# EAGLE schematic UCirKitBreadboardWithEverything3 (EAGLE 7.3.0), part 1 of 3
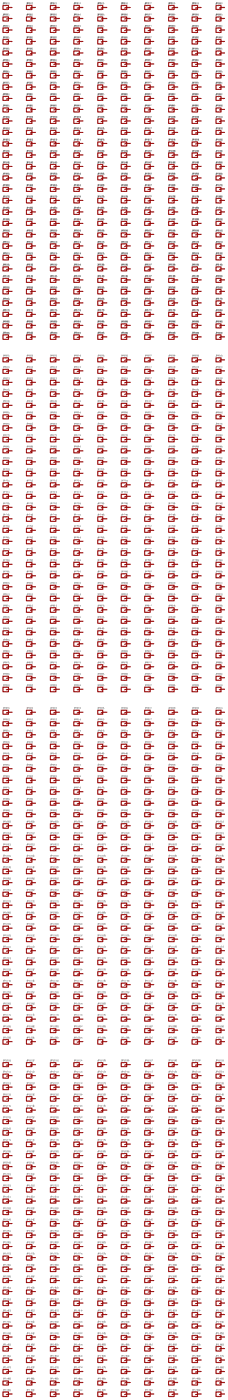
[diagram p0: schematic, sheet 1, overview]
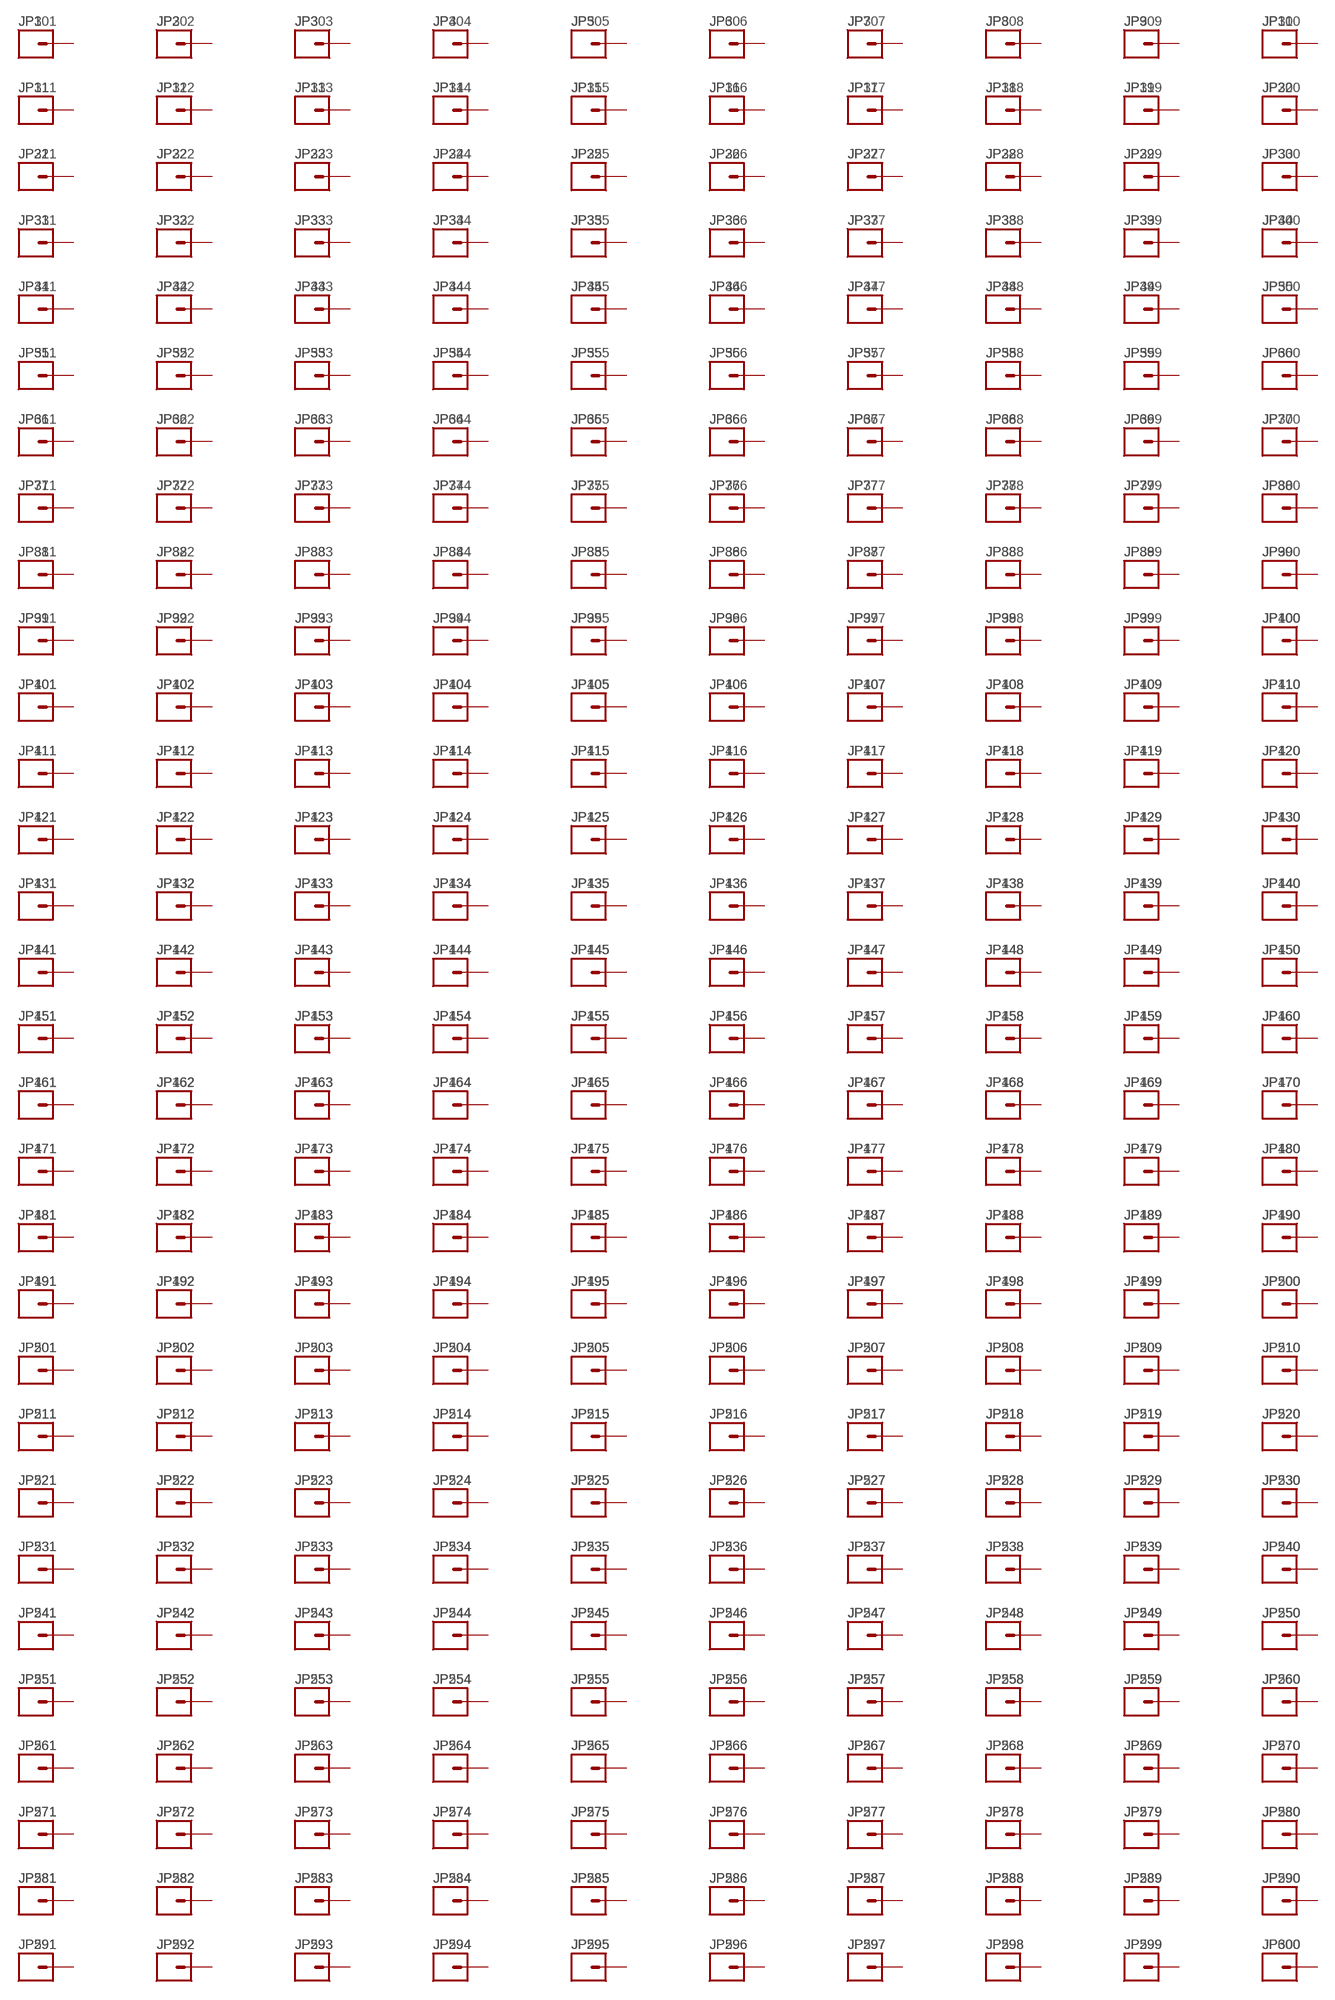
[diagram p1: schematic, sheet 1, part 1 of 4]
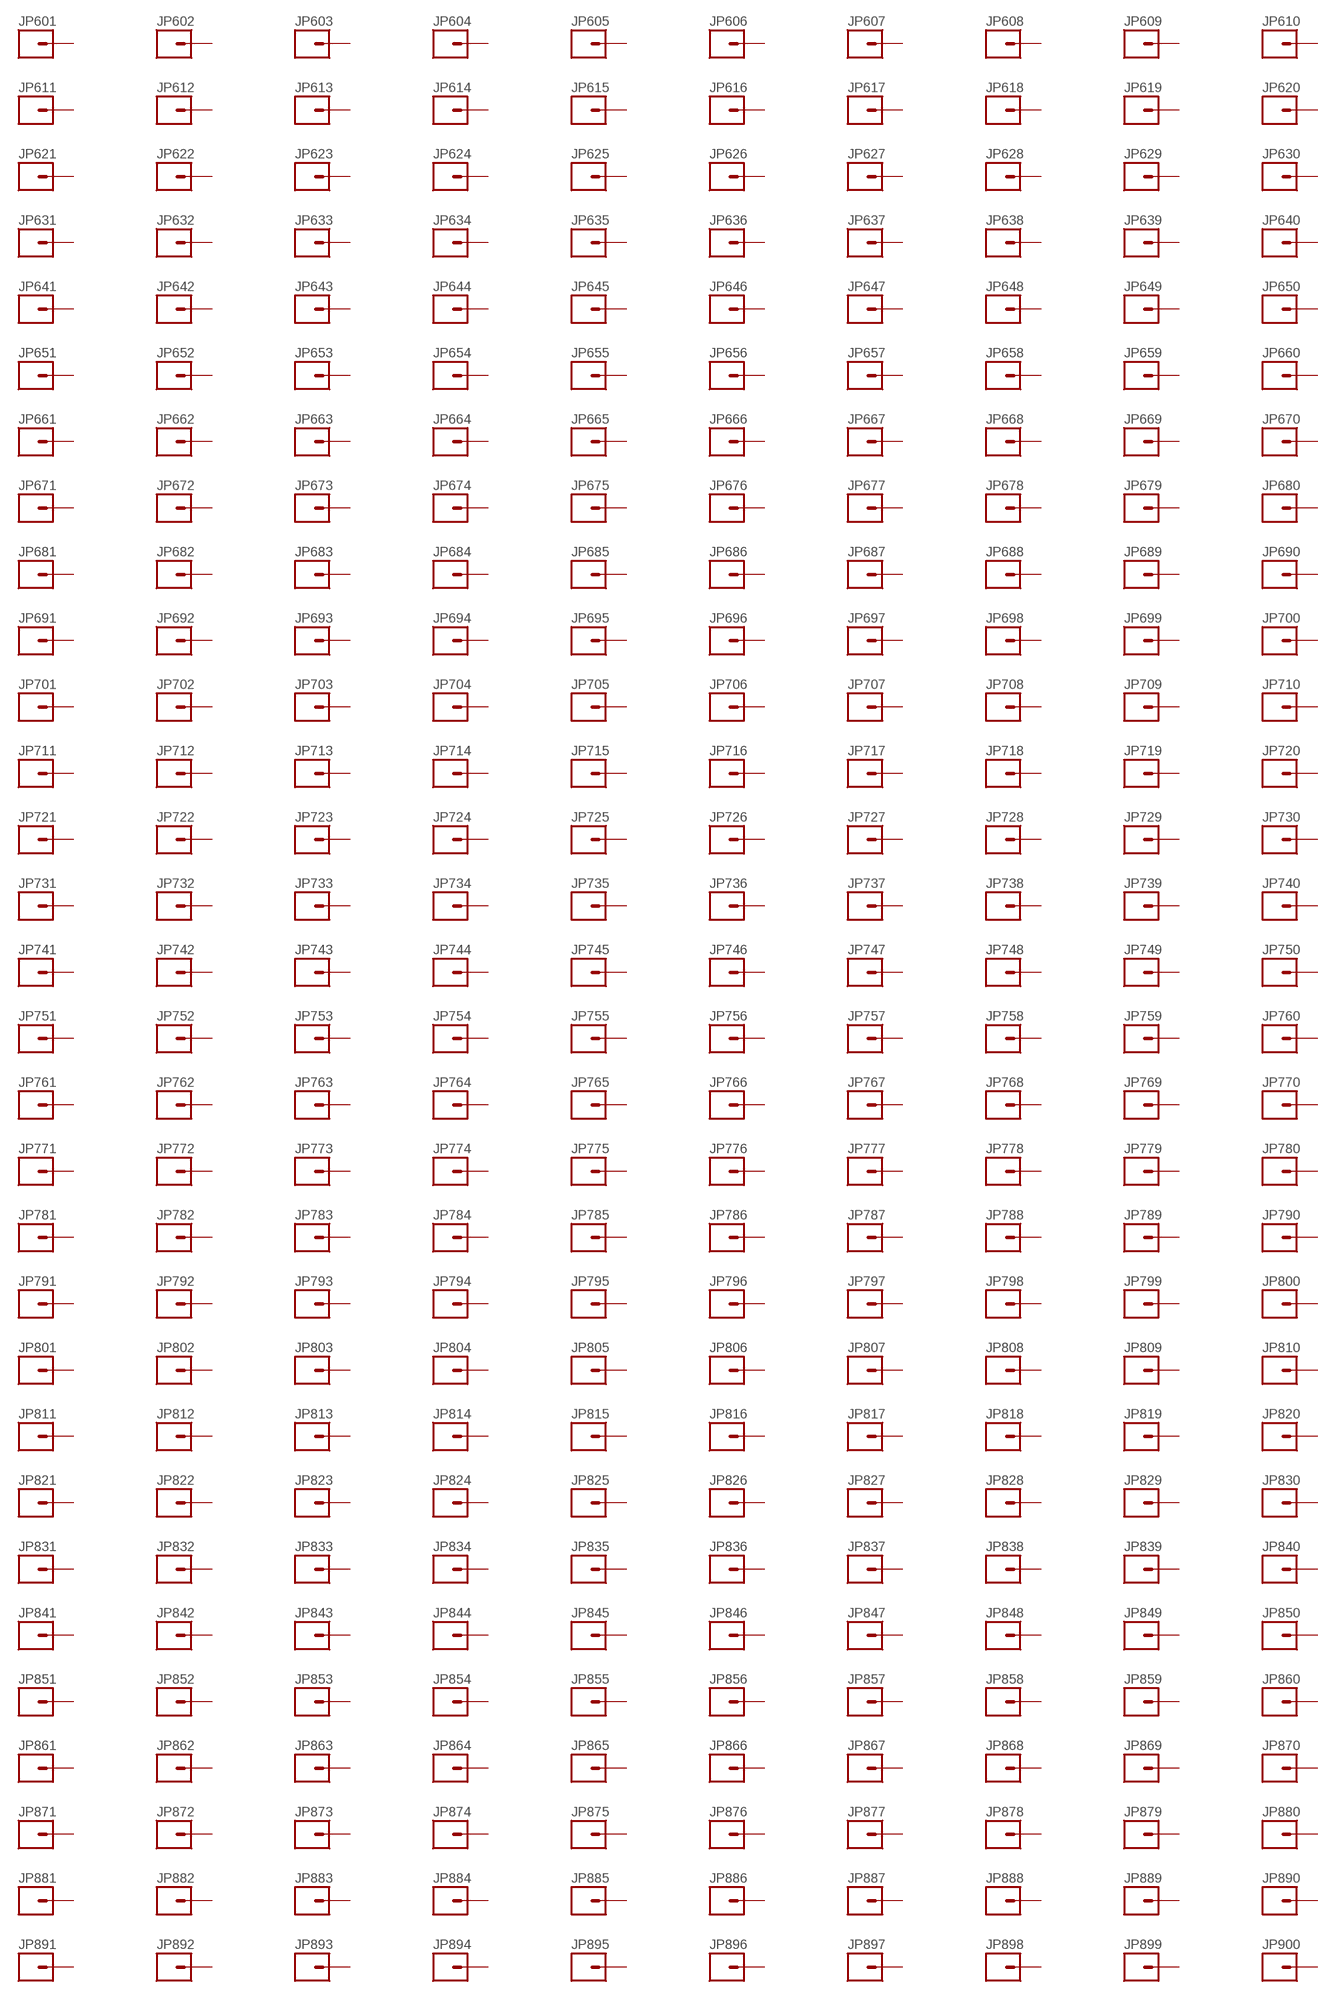
[diagram p2: schematic, sheet 1, part 2 of 4]
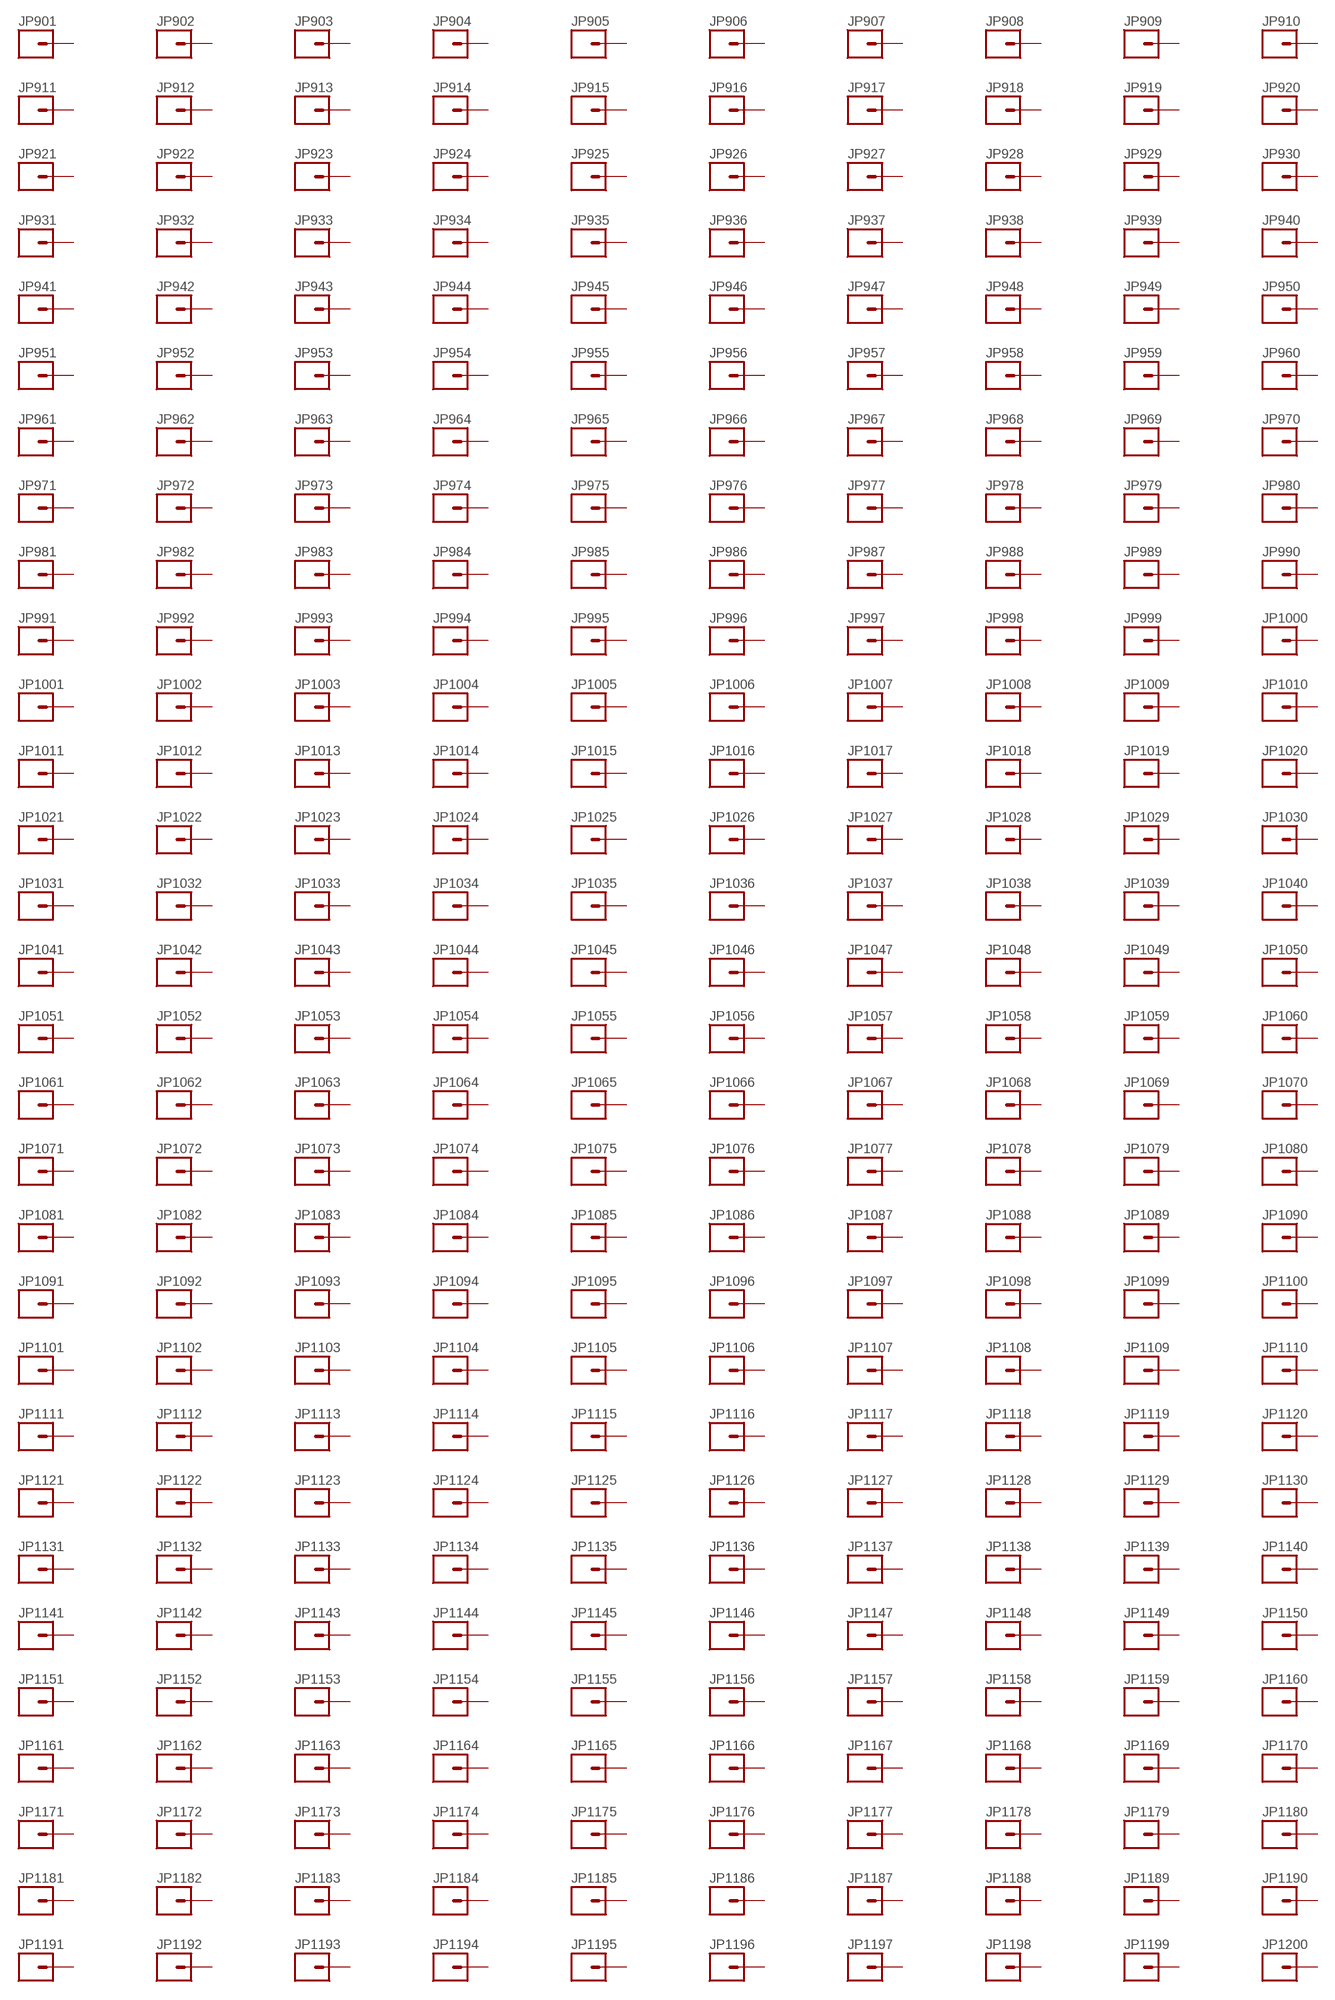
[diagram p3: schematic, sheet 1, part 3 of 4]
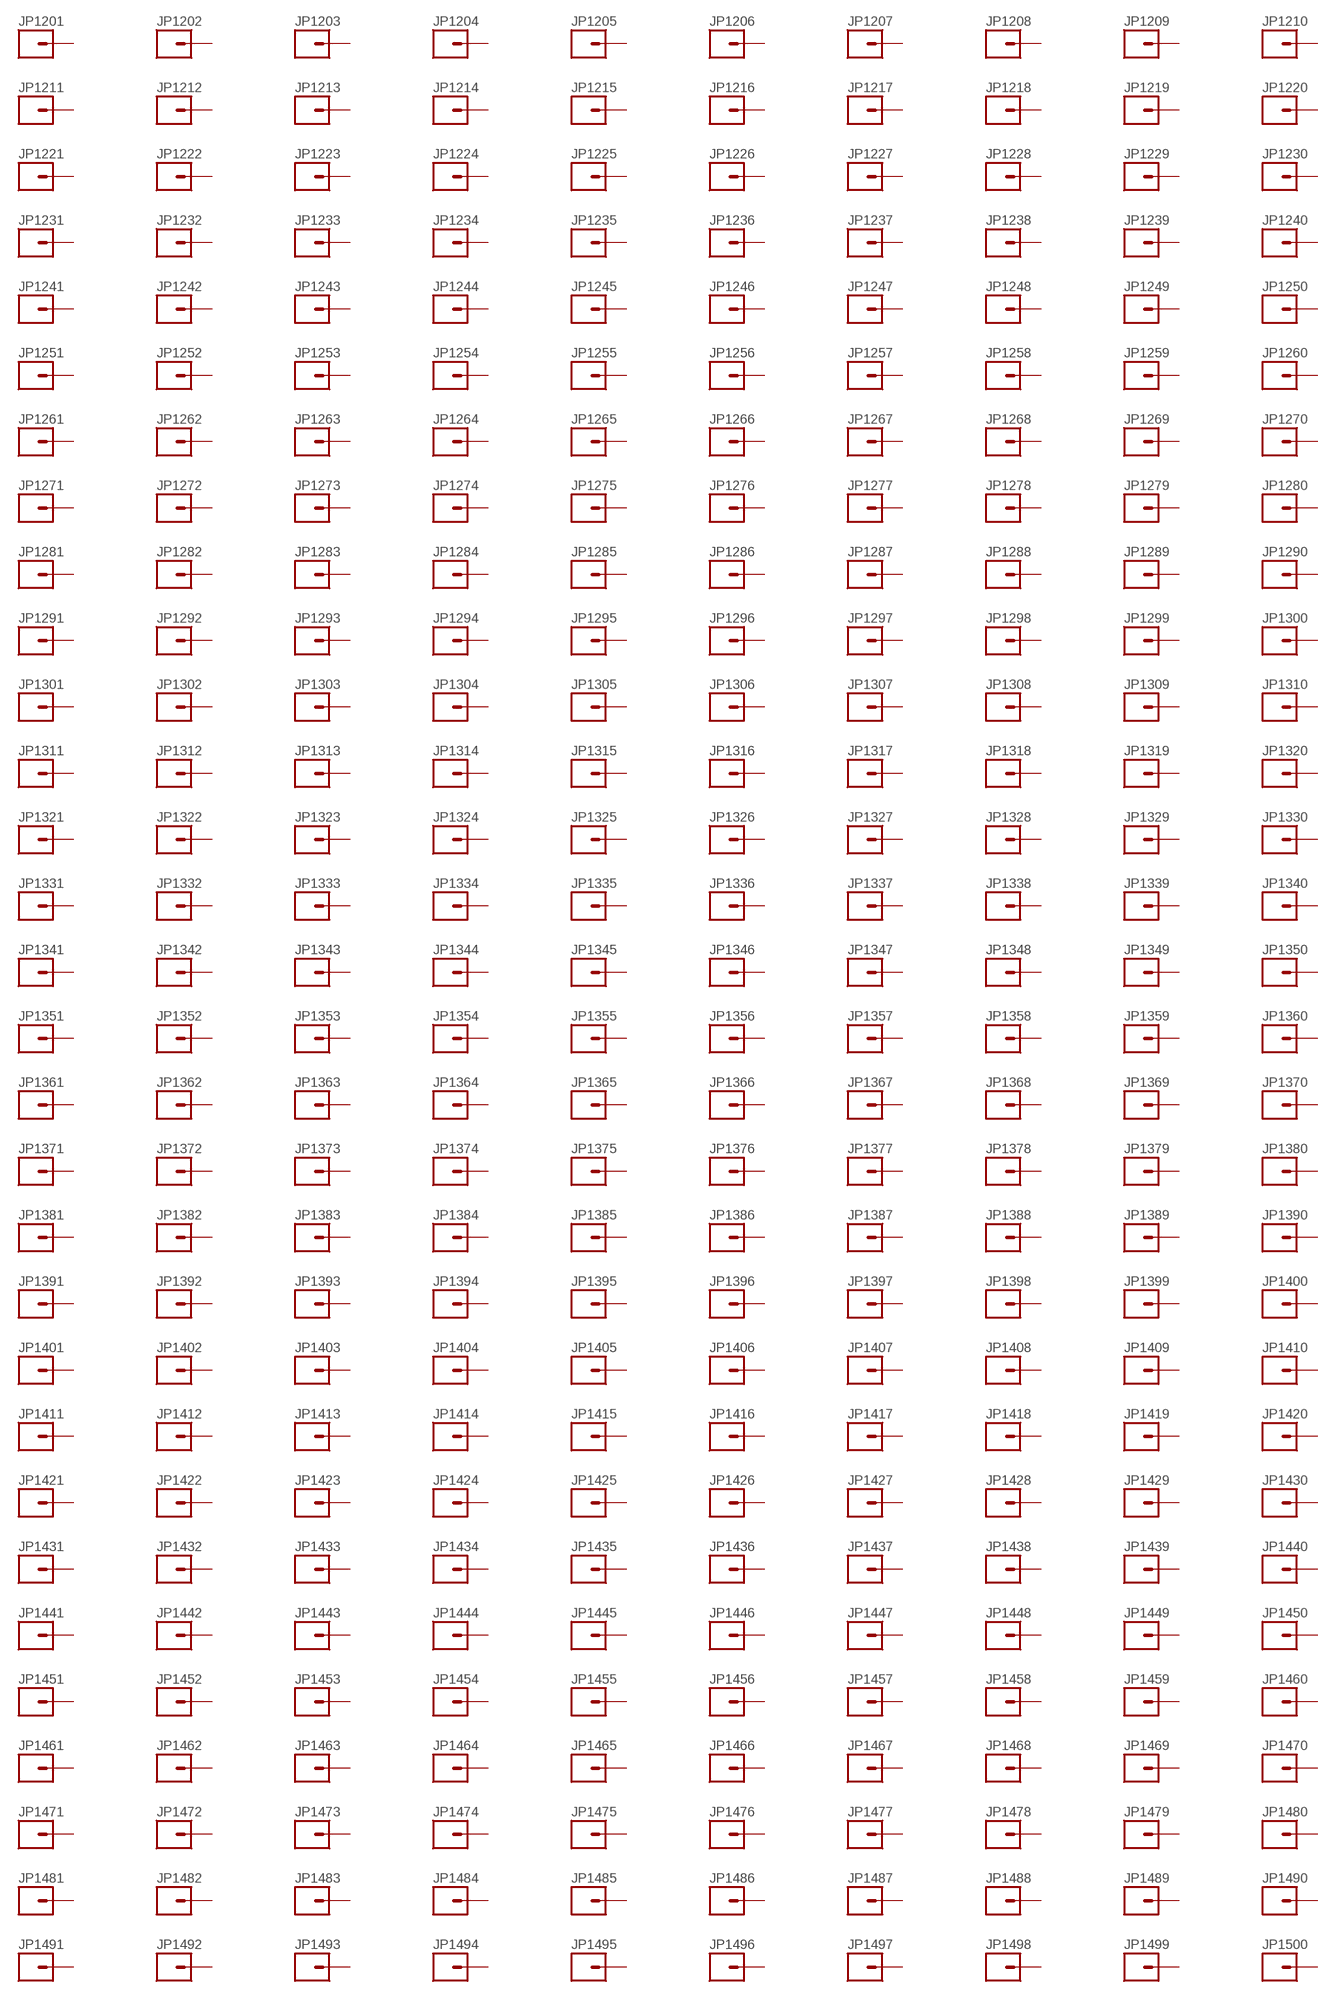
[diagram p4: schematic, sheet 1, part 4 of 4]

## Parts
JP1  M01PTH_WITHOUT_TEXT  [1X01_WITHOUT_TEXT]
JP2  M01PTH_WITHOUT_TEXT  [1X01_WITHOUT_TEXT]
JP3  M01PTH_WITHOUT_TEXT  [1X01_WITHOUT_TEXT]
JP4  M01PTH_WITHOUT_TEXT  [1X01_WITHOUT_TEXT]
JP5  M01PTH_WITHOUT_TEXT  [1X01_WITHOUT_TEXT]
JP6  M01PTH_WITHOUT_TEXT  [1X01_WITHOUT_TEXT]
JP7  M01PTH_WITHOUT_TEXT  [1X01_WITHOUT_TEXT]
JP8  M01PTH_WITHOUT_TEXT  [1X01_WITHOUT_TEXT]
JP9  M01PTH_WITHOUT_TEXT  [1X01_WITHOUT_TEXT]
JP10  M01PTH_WITHOUT_TEXT  [1X01_WITHOUT_TEXT]
JP11  M01PTH_WITHOUT_TEXT  [1X01_WITHOUT_TEXT]
JP12  M01PTH_WITHOUT_TEXT  [1X01_WITHOUT_TEXT]
JP13  M01PTH_WITHOUT_TEXT  [1X01_WITHOUT_TEXT]
JP14  M01PTH_WITHOUT_TEXT  [1X01_WITHOUT_TEXT]
JP15  M01PTH_WITHOUT_TEXT  [1X01_WITHOUT_TEXT]
JP16  M01PTH_WITHOUT_TEXT  [1X01_WITHOUT_TEXT]
JP17  M01PTH_WITHOUT_TEXT  [1X01_WITHOUT_TEXT]
JP18  M01PTH_WITHOUT_TEXT  [1X01_WITHOUT_TEXT]
JP19  M01PTH_WITHOUT_TEXT  [1X01_WITHOUT_TEXT]
JP20  M01PTH_WITHOUT_TEXT  [1X01_WITHOUT_TEXT]
JP21  M01PTH_WITHOUT_TEXT  [1X01_WITHOUT_TEXT]
JP22  M01PTH_WITHOUT_TEXT  [1X01_WITHOUT_TEXT]
JP23  M01PTH_WITHOUT_TEXT  [1X01_WITHOUT_TEXT]
JP24  M01PTH_WITHOUT_TEXT  [1X01_WITHOUT_TEXT]
JP25  M01PTH_WITHOUT_TEXT  [1X01_WITHOUT_TEXT]
JP26  M01PTH_WITHOUT_TEXT  [1X01_WITHOUT_TEXT]
JP27  M01PTH_WITHOUT_TEXT  [1X01_WITHOUT_TEXT]
JP28  M01PTH_WITHOUT_TEXT  [1X01_WITHOUT_TEXT]
JP29  M01PTH_WITHOUT_TEXT  [1X01_WITHOUT_TEXT]
JP30  M01PTH_WITHOUT_TEXT  [1X01_WITHOUT_TEXT]
JP31  M01PTH_WITHOUT_TEXT  [1X01_WITHOUT_TEXT]
JP32  M01PTH_WITHOUT_TEXT  [1X01_WITHOUT_TEXT]
JP33  M01PTH_WITHOUT_TEXT  [1X01_WITHOUT_TEXT]
JP34  M01PTH_WITHOUT_TEXT  [1X01_WITHOUT_TEXT]
JP35  M01PTH_WITHOUT_TEXT  [1X01_WITHOUT_TEXT]
JP36  M01PTH_WITHOUT_TEXT  [1X01_WITHOUT_TEXT]
JP37  M01PTH_WITHOUT_TEXT  [1X01_WITHOUT_TEXT]
JP38  M01PTH_WITHOUT_TEXT  [1X01_WITHOUT_TEXT]
JP39  M01PTH_WITHOUT_TEXT  [1X01_WITHOUT_TEXT]
JP40  M01PTH_WITHOUT_TEXT  [1X01_WITHOUT_TEXT]
JP41  M01PTH_WITHOUT_TEXT  [1X01_WITHOUT_TEXT]
JP42  M01PTH_WITHOUT_TEXT  [1X01_WITHOUT_TEXT]
JP43  M01PTH_WITHOUT_TEXT  [1X01_WITHOUT_TEXT]
JP44  M01PTH_WITHOUT_TEXT  [1X01_WITHOUT_TEXT]
JP45  M01PTH_WITHOUT_TEXT  [1X01_WITHOUT_TEXT]
JP46  M01PTH_WITHOUT_TEXT  [1X01_WITHOUT_TEXT]
JP47  M01PTH_WITHOUT_TEXT  [1X01_WITHOUT_TEXT]
JP48  M01PTH_WITHOUT_TEXT  [1X01_WITHOUT_TEXT]
JP49  M01PTH_WITHOUT_TEXT  [1X01_WITHOUT_TEXT]
JP50  M01PTH_WITHOUT_TEXT  [1X01_WITHOUT_TEXT]
JP51  M01PTH_WITHOUT_TEXT  [1X01_WITHOUT_TEXT]
JP52  M01PTH_WITHOUT_TEXT  [1X01_WITHOUT_TEXT]
JP53  M01PTH_WITHOUT_TEXT  [1X01_WITHOUT_TEXT]
JP54  M01PTH_WITHOUT_TEXT  [1X01_WITHOUT_TEXT]
JP55  M01PTH_WITHOUT_TEXT  [1X01_WITHOUT_TEXT]
JP56  M01PTH_WITHOUT_TEXT  [1X01_WITHOUT_TEXT]
JP57  M01PTH_WITHOUT_TEXT  [1X01_WITHOUT_TEXT]
JP58  M01PTH_WITHOUT_TEXT  [1X01_WITHOUT_TEXT]
JP59  M01PTH_WITHOUT_TEXT  [1X01_WITHOUT_TEXT]
JP60  M01PTH_WITHOUT_TEXT  [1X01_WITHOUT_TEXT]
JP61  M01PTH_WITHOUT_TEXT  [1X01_WITHOUT_TEXT]
JP62  M01PTH_WITHOUT_TEXT  [1X01_WITHOUT_TEXT]
JP63  M01PTH_WITHOUT_TEXT  [1X01_WITHOUT_TEXT]
JP64  M01PTH_WITHOUT_TEXT  [1X01_WITHOUT_TEXT]
JP65  M01PTH_WITHOUT_TEXT  [1X01_WITHOUT_TEXT]
JP66  M01PTH_WITHOUT_TEXT  [1X01_WITHOUT_TEXT]
JP67  M01PTH_WITHOUT_TEXT  [1X01_WITHOUT_TEXT]
JP68  M01PTH_WITHOUT_TEXT  [1X01_WITHOUT_TEXT]
JP69  M01PTH_WITHOUT_TEXT  [1X01_WITHOUT_TEXT]
JP70  M01PTH_WITHOUT_TEXT  [1X01_WITHOUT_TEXT]
JP71  M01PTH_WITHOUT_TEXT  [1X01_WITHOUT_TEXT]
JP72  M01PTH_WITHOUT_TEXT  [1X01_WITHOUT_TEXT]
JP73  M01PTH_WITHOUT_TEXT  [1X01_WITHOUT_TEXT]
JP74  M01PTH_WITHOUT_TEXT  [1X01_WITHOUT_TEXT]
JP75  M01PTH_WITHOUT_TEXT  [1X01_WITHOUT_TEXT]
JP76  M01PTH_WITHOUT_TEXT  [1X01_WITHOUT_TEXT]
JP77  M01PTH_WITHOUT_TEXT  [1X01_WITHOUT_TEXT]
JP78  M01PTH_WITHOUT_TEXT  [1X01_WITHOUT_TEXT]
JP79  M01PTH_WITHOUT_TEXT  [1X01_WITHOUT_TEXT]
JP80  M01PTH_WITHOUT_TEXT  [1X01_WITHOUT_TEXT]
JP81  M01PTH_WITHOUT_TEXT  [1X01_WITHOUT_TEXT]
JP82  M01PTH_WITHOUT_TEXT  [1X01_WITHOUT_TEXT]
JP83  M01PTH_WITHOUT_TEXT  [1X01_WITHOUT_TEXT]
JP84  M01PTH_WITHOUT_TEXT  [1X01_WITHOUT_TEXT]
JP85  M01PTH_WITHOUT_TEXT  [1X01_WITHOUT_TEXT]
JP86  M01PTH_WITHOUT_TEXT  [1X01_WITHOUT_TEXT]
JP87  M01PTH_WITHOUT_TEXT  [1X01_WITHOUT_TEXT]
JP88  M01PTH_WITHOUT_TEXT  [1X01_WITHOUT_TEXT]
JP89  M01PTH_WITHOUT_TEXT  [1X01_WITHOUT_TEXT]
JP90  M01PTH_WITHOUT_TEXT  [1X01_WITHOUT_TEXT]
JP91  M01PTH_WITHOUT_TEXT  [1X01_WITHOUT_TEXT]
JP92  M01PTH_WITHOUT_TEXT  [1X01_WITHOUT_TEXT]
JP93  M01PTH_WITHOUT_TEXT  [1X01_WITHOUT_TEXT]
JP94  M01PTH_WITHOUT_TEXT  [1X01_WITHOUT_TEXT]
JP95  M01PTH_WITHOUT_TEXT  [1X01_WITHOUT_TEXT]
JP96  M01PTH_WITHOUT_TEXT  [1X01_WITHOUT_TEXT]
JP97  M01PTH_WITHOUT_TEXT  [1X01_WITHOUT_TEXT]
JP98  M01PTH_WITHOUT_TEXT  [1X01_WITHOUT_TEXT]
JP99  M01PTH_WITHOUT_TEXT  [1X01_WITHOUT_TEXT]
JP100  M01PTH_WITHOUT_TEXT  [1X01_WITHOUT_TEXT]
JP101  M01PTH_WITHOUT_TEXT  [1X01_WITHOUT_TEXT]
JP102  M01PTH_WITHOUT_TEXT  [1X01_WITHOUT_TEXT]
JP103  M01PTH_WITHOUT_TEXT  [1X01_WITHOUT_TEXT]
JP104  M01PTH_WITHOUT_TEXT  [1X01_WITHOUT_TEXT]
JP105  M01PTH_WITHOUT_TEXT  [1X01_WITHOUT_TEXT]
JP106  M01PTH_WITHOUT_TEXT  [1X01_WITHOUT_TEXT]
JP107  M01PTH_WITHOUT_TEXT  [1X01_WITHOUT_TEXT]
JP108  M01PTH_WITHOUT_TEXT  [1X01_WITHOUT_TEXT]
JP109  M01PTH_WITHOUT_TEXT  [1X01_WITHOUT_TEXT]
JP110  M01PTH_WITHOUT_TEXT  [1X01_WITHOUT_TEXT]
JP111  M01PTH_WITHOUT_TEXT  [1X01_WITHOUT_TEXT]
JP112  M01PTH_WITHOUT_TEXT  [1X01_WITHOUT_TEXT]
JP113  M01PTH_WITHOUT_TEXT  [1X01_WITHOUT_TEXT]
JP114  M01PTH_WITHOUT_TEXT  [1X01_WITHOUT_TEXT]
JP115  M01PTH_WITHOUT_TEXT  [1X01_WITHOUT_TEXT]
JP116  M01PTH_WITHOUT_TEXT  [1X01_WITHOUT_TEXT]
JP117  M01PTH_WITHOUT_TEXT  [1X01_WITHOUT_TEXT]
JP118  M01PTH_WITHOUT_TEXT  [1X01_WITHOUT_TEXT]
JP119  M01PTH_WITHOUT_TEXT  [1X01_WITHOUT_TEXT]
JP120  M01PTH_WITHOUT_TEXT  [1X01_WITHOUT_TEXT]
JP121  M01PTH_WITHOUT_TEXT  [1X01_WITHOUT_TEXT]
JP122  M01PTH_WITHOUT_TEXT  [1X01_WITHOUT_TEXT]
JP123  M01PTH_WITHOUT_TEXT  [1X01_WITHOUT_TEXT]
JP124  M01PTH_WITHOUT_TEXT  [1X01_WITHOUT_TEXT]
JP125  M01PTH_WITHOUT_TEXT  [1X01_WITHOUT_TEXT]
JP126  M01PTH_WITHOUT_TEXT  [1X01_WITHOUT_TEXT]
JP127  M01PTH_WITHOUT_TEXT  [1X01_WITHOUT_TEXT]
JP128  M01PTH_WITHOUT_TEXT  [1X01_WITHOUT_TEXT]
JP129  M01PTH_WITHOUT_TEXT  [1X01_WITHOUT_TEXT]
JP130  M01PTH_WITHOUT_TEXT  [1X01_WITHOUT_TEXT]
JP131  M01PTH_WITHOUT_TEXT  [1X01_WITHOUT_TEXT]
JP132  M01PTH_WITHOUT_TEXT  [1X01_WITHOUT_TEXT]
JP133  M01PTH_WITHOUT_TEXT  [1X01_WITHOUT_TEXT]
JP134  M01PTH_WITHOUT_TEXT  [1X01_WITHOUT_TEXT]
JP135  M01PTH_WITHOUT_TEXT  [1X01_WITHOUT_TEXT]
JP136  M01PTH_WITHOUT_TEXT  [1X01_WITHOUT_TEXT]
JP137  M01PTH_WITHOUT_TEXT  [1X01_WITHOUT_TEXT]
JP138  M01PTH_WITHOUT_TEXT  [1X01_WITHOUT_TEXT]
JP139  M01PTH_WITHOUT_TEXT  [1X01_WITHOUT_TEXT]
JP140  M01PTH_WITHOUT_TEXT  [1X01_WITHOUT_TEXT]
JP141  M01PTH_WITHOUT_TEXT  [1X01_WITHOUT_TEXT]
JP142  M01PTH_WITHOUT_TEXT  [1X01_WITHOUT_TEXT]
JP143  M01PTH_WITHOUT_TEXT  [1X01_WITHOUT_TEXT]
JP144  M01PTH_WITHOUT_TEXT  [1X01_WITHOUT_TEXT]
JP145  M01PTH_WITHOUT_TEXT  [1X01_WITHOUT_TEXT]
JP146  M01PTH_WITHOUT_TEXT  [1X01_WITHOUT_TEXT]
JP147  M01PTH_WITHOUT_TEXT  [1X01_WITHOUT_TEXT]
JP148  M01PTH_WITHOUT_TEXT  [1X01_WITHOUT_TEXT]
JP149  M01PTH_WITHOUT_TEXT  [1X01_WITHOUT_TEXT]
JP150  M01PTH_WITHOUT_TEXT  [1X01_WITHOUT_TEXT]
JP151  M01PTH_WITHOUT_TEXT  [1X01_WITHOUT_TEXT]
JP152  M01PTH_WITHOUT_TEXT  [1X01_WITHOUT_TEXT]
JP153  M01PTH_WITHOUT_TEXT  [1X01_WITHOUT_TEXT]
JP154  M01PTH_WITHOUT_TEXT  [1X01_WITHOUT_TEXT]
JP155  M01PTH_WITHOUT_TEXT  [1X01_WITHOUT_TEXT]
JP156  M01PTH_WITHOUT_TEXT  [1X01_WITHOUT_TEXT]
JP157  M01PTH_WITHOUT_TEXT  [1X01_WITHOUT_TEXT]
JP158  M01PTH_WITHOUT_TEXT  [1X01_WITHOUT_TEXT]
JP159  M01PTH_WITHOUT_TEXT  [1X01_WITHOUT_TEXT]
JP160  M01PTH_WITHOUT_TEXT  [1X01_WITHOUT_TEXT]
JP161  M01PTH_WITHOUT_TEXT  [1X01_WITHOUT_TEXT]
JP162  M01PTH_WITHOUT_TEXT  [1X01_WITHOUT_TEXT]
JP163  M01PTH_WITHOUT_TEXT  [1X01_WITHOUT_TEXT]
JP164  M01PTH_WITHOUT_TEXT  [1X01_WITHOUT_TEXT]
JP165  M01PTH_WITHOUT_TEXT  [1X01_WITHOUT_TEXT]
JP166  M01PTH_WITHOUT_TEXT  [1X01_WITHOUT_TEXT]
JP167  M01PTH_WITHOUT_TEXT  [1X01_WITHOUT_TEXT]
JP168  M01PTH_WITHOUT_TEXT  [1X01_WITHOUT_TEXT]
JP169  M01PTH_WITHOUT_TEXT  [1X01_WITHOUT_TEXT]
JP170  M01PTH_WITHOUT_TEXT  [1X01_WITHOUT_TEXT]
JP171  M01PTH_WITHOUT_TEXT  [1X01_WITHOUT_TEXT]
JP172  M01PTH_WITHOUT_TEXT  [1X01_WITHOUT_TEXT]
JP173  M01PTH_WITHOUT_TEXT  [1X01_WITHOUT_TEXT]
JP174  M01PTH_WITHOUT_TEXT  [1X01_WITHOUT_TEXT]
JP175  M01PTH_WITHOUT_TEXT  [1X01_WITHOUT_TEXT]
JP176  M01PTH_WITHOUT_TEXT  [1X01_WITHOUT_TEXT]
JP177  M01PTH_WITHOUT_TEXT  [1X01_WITHOUT_TEXT]
JP178  M01PTH_WITHOUT_TEXT  [1X01_WITHOUT_TEXT]
JP179  M01PTH_WITHOUT_TEXT  [1X01_WITHOUT_TEXT]
JP180  M01PTH_WITHOUT_TEXT  [1X01_WITHOUT_TEXT]
JP181  M01PTH_WITHOUT_TEXT  [1X01_WITHOUT_TEXT]
JP182  M01PTH_WITHOUT_TEXT  [1X01_WITHOUT_TEXT]
JP183  M01PTH_WITHOUT_TEXT  [1X01_WITHOUT_TEXT]
JP184  M01PTH_WITHOUT_TEXT  [1X01_WITHOUT_TEXT]
JP185  M01PTH_WITHOUT_TEXT  [1X01_WITHOUT_TEXT]
JP186  M01PTH_WITHOUT_TEXT  [1X01_WITHOUT_TEXT]
JP187  M01PTH_WITHOUT_TEXT  [1X01_WITHOUT_TEXT]
JP188  M01PTH_WITHOUT_TEXT  [1X01_WITHOUT_TEXT]
JP189  M01PTH_WITHOUT_TEXT  [1X01_WITHOUT_TEXT]
JP190  M01PTH_WITHOUT_TEXT  [1X01_WITHOUT_TEXT]
JP191  M01PTH_WITHOUT_TEXT  [1X01_WITHOUT_TEXT]
JP192  M01PTH_WITHOUT_TEXT  [1X01_WITHOUT_TEXT]
JP193  M01PTH_WITHOUT_TEXT  [1X01_WITHOUT_TEXT]
JP194  M01PTH_WITHOUT_TEXT  [1X01_WITHOUT_TEXT]
JP195  M01PTH_WITHOUT_TEXT  [1X01_WITHOUT_TEXT]
JP196  M01PTH_WITHOUT_TEXT  [1X01_WITHOUT_TEXT]
JP197  M01PTH_WITHOUT_TEXT  [1X01_WITHOUT_TEXT]
JP198  M01PTH_WITHOUT_TEXT  [1X01_WITHOUT_TEXT]
JP199  M01PTH_WITHOUT_TEXT  [1X01_WITHOUT_TEXT]
JP200  M01PTH_WITHOUT_TEXT  [1X01_WITHOUT_TEXT]
JP201  M01PTH_WITHOUT_TEXT  [1X01_WITHOUT_TEXT]
JP202  M01PTH_WITHOUT_TEXT  [1X01_WITHOUT_TEXT]
JP203  M01PTH_WITHOUT_TEXT  [1X01_WITHOUT_TEXT]
JP204  M01PTH_WITHOUT_TEXT  [1X01_WITHOUT_TEXT]
JP205  M01PTH_WITHOUT_TEXT  [1X01_WITHOUT_TEXT]
JP206  M01PTH_WITHOUT_TEXT  [1X01_WITHOUT_TEXT]
JP207  M01PTH_WITHOUT_TEXT  [1X01_WITHOUT_TEXT]
JP208  M01PTH_WITHOUT_TEXT  [1X01_WITHOUT_TEXT]
JP209  M01PTH_WITHOUT_TEXT  [1X01_WITHOUT_TEXT]
JP210  M01PTH_WITHOUT_TEXT  [1X01_WITHOUT_TEXT]
JP211  M01PTH_WITHOUT_TEXT  [1X01_WITHOUT_TEXT]
JP212  M01PTH_WITHOUT_TEXT  [1X01_WITHOUT_TEXT]
JP213  M01PTH_WITHOUT_TEXT  [1X01_WITHOUT_TEXT]
JP214  M01PTH_WITHOUT_TEXT  [1X01_WITHOUT_TEXT]
JP215  M01PTH_WITHOUT_TEXT  [1X01_WITHOUT_TEXT]
JP216  M01PTH_WITHOUT_TEXT  [1X01_WITHOUT_TEXT]
JP217  M01PTH_WITHOUT_TEXT  [1X01_WITHOUT_TEXT]
JP218  M01PTH_WITHOUT_TEXT  [1X01_WITHOUT_TEXT]
JP219  M01PTH_WITHOUT_TEXT  [1X01_WITHOUT_TEXT]
JP220  M01PTH_WITHOUT_TEXT  [1X01_WITHOUT_TEXT]
JP221  M01PTH_WITHOUT_TEXT  [1X01_WITHOUT_TEXT]
JP222  M01PTH_WITHOUT_TEXT  [1X01_WITHOUT_TEXT]
JP223  M01PTH_WITHOUT_TEXT  [1X01_WITHOUT_TEXT]
JP224  M01PTH_WITHOUT_TEXT  [1X01_WITHOUT_TEXT]
JP225  M01PTH_WITHOUT_TEXT  [1X01_WITHOUT_TEXT]
JP226  M01PTH_WITHOUT_TEXT  [1X01_WITHOUT_TEXT]
JP227  M01PTH_WITHOUT_TEXT  [1X01_WITHOUT_TEXT]
JP228  M01PTH_WITHOUT_TEXT  [1X01_WITHOUT_TEXT]
JP229  M01PTH_WITHOUT_TEXT  [1X01_WITHOUT_TEXT]
JP230  M01PTH_WITHOUT_TEXT  [1X01_WITHOUT_TEXT]
JP231  M01PTH_WITHOUT_TEXT  [1X01_WITHOUT_TEXT]
JP232  M01PTH_WITHOUT_TEXT  [1X01_WITHOUT_TEXT]
JP233  M01PTH_WITHOUT_TEXT  [1X01_WITHOUT_TEXT]
JP234  M01PTH_WITHOUT_TEXT  [1X01_WITHOUT_TEXT]
JP235  M01PTH_WITHOUT_TEXT  [1X01_WITHOUT_TEXT]
JP236  M01PTH_WITHOUT_TEXT  [1X01_WITHOUT_TEXT]
JP237  M01PTH_WITHOUT_TEXT  [1X01_WITHOUT_TEXT]
JP238  M01PTH_WITHOUT_TEXT  [1X01_WITHOUT_TEXT]
JP239  M01PTH_WITHOUT_TEXT  [1X01_WITHOUT_TEXT]
JP240  M01PTH_WITHOUT_TEXT  [1X01_WITHOUT_TEXT]
JP241  M01PTH_WITHOUT_TEXT  [1X01_WITHOUT_TEXT]
JP242  M01PTH_WITHOUT_TEXT  [1X01_WITHOUT_TEXT]
JP243  M01PTH_WITHOUT_TEXT  [1X01_WITHOUT_TEXT]
JP244  M01PTH_WITHOUT_TEXT  [1X01_WITHOUT_TEXT]
JP245  M01PTH_WITHOUT_TEXT  [1X01_WITHOUT_TEXT]
JP246  M01PTH_WITHOUT_TEXT  [1X01_WITHOUT_TEXT]
JP247  M01PTH_WITHOUT_TEXT  [1X01_WITHOUT_TEXT]
JP248  M01PTH_WITHOUT_TEXT  [1X01_WITHOUT_TEXT]
JP249  M01PTH_WITHOUT_TEXT  [1X01_WITHOUT_TEXT]
JP250  M01PTH_WITHOUT_TEXT  [1X01_WITHOUT_TEXT]
JP251  M01PTH_WITHOUT_TEXT  [1X01_WITHOUT_TEXT]
JP252  M01PTH_WITHOUT_TEXT  [1X01_WITHOUT_TEXT]
JP253  M01PTH_WITHOUT_TEXT  [1X01_WITHOUT_TEXT]
JP254  M01PTH_WITHOUT_TEXT  [1X01_WITHOUT_TEXT]
JP255  M01PTH_WITHOUT_TEXT  [1X01_WITHOUT_TEXT]
JP256  M01PTH_WITHOUT_TEXT  [1X01_WITHOUT_TEXT]
JP257  M01PTH_WITHOUT_TEXT  [1X01_WITHOUT_TEXT]
JP258  M01PTH_WITHOUT_TEXT  [1X01_WITHOUT_TEXT]
JP259  M01PTH_WITHOUT_TEXT  [1X01_WITHOUT_TEXT]
JP260  M01PTH_WITHOUT_TEXT  [1X01_WITHOUT_TEXT]
JP261  M01PTH_WITHOUT_TEXT  [1X01_WITHOUT_TEXT]
JP262  M01PTH_WITHOUT_TEXT  [1X01_WITHOUT_TEXT]
JP263  M01PTH_WITHOUT_TEXT  [1X01_WITHOUT_TEXT]
JP264  M01PTH_WITHOUT_TEXT  [1X01_WITHOUT_TEXT]
JP265  M01PTH_WITHOUT_TEXT  [1X01_WITHOUT_TEXT]
JP266  M01PTH_WITHOUT_TEXT  [1X01_WITHOUT_TEXT]
JP267  M01PTH_WITHOUT_TEXT  [1X01_WITHOUT_TEXT]
JP268  M01PTH_WITHOUT_TEXT  [1X01_WITHOUT_TEXT]
JP269  M01PTH_WITHOUT_TEXT  [1X01_WITHOUT_TEXT]
JP270  M01PTH_WITHOUT_TEXT  [1X01_WITHOUT_TEXT]
JP271  M01PTH_WITHOUT_TEXT  [1X01_WITHOUT_TEXT]
JP272  M01PTH_WITHOUT_TEXT  [1X01_WITHOUT_TEXT]
JP273  M01PTH_WITHOUT_TEXT  [1X01_WITHOUT_TEXT]
JP274  M01PTH_WITHOUT_TEXT  [1X01_WITHOUT_TEXT]
JP275  M01PTH_WITHOUT_TEXT  [1X01_WITHOUT_TEXT]
JP276  M01PTH_WITHOUT_TEXT  [1X01_WITHOUT_TEXT]
JP277  M01PTH_WITHOUT_TEXT  [1X01_WITHOUT_TEXT]
JP278  M01PTH_WITHOUT_TEXT  [1X01_WITHOUT_TEXT]
JP279  M01PTH_WITHOUT_TEXT  [1X01_WITHOUT_TEXT]
JP280  M01PTH_WITHOUT_TEXT  [1X01_WITHOUT_TEXT]
JP281  M01PTH_WITHOUT_TEXT  [1X01_WITHOUT_TEXT]
JP282  M01PTH_WITHOUT_TEXT  [1X01_WITHOUT_TEXT]
JP283  M01PTH_WITHOUT_TEXT  [1X01_WITHOUT_TEXT]
JP284  M01PTH_WITHOUT_TEXT  [1X01_WITHOUT_TEXT]
JP285  M01PTH_WITHOUT_TEXT  [1X01_WITHOUT_TEXT]
JP286  M01PTH_WITHOUT_TEXT  [1X01_WITHOUT_TEXT]
JP287  M01PTH_WITHOUT_TEXT  [1X01_WITHOUT_TEXT]
JP288  M01PTH_WITHOUT_TEXT  [1X01_WITHOUT_TEXT]
JP289  M01PTH_WITHOUT_TEXT  [1X01_WITHOUT_TEXT]
JP290  M01PTH_WITHOUT_TEXT  [1X01_WITHOUT_TEXT]
JP291  M01PTH_WITHOUT_TEXT  [1X01_WITHOUT_TEXT]
JP292  M01PTH_WITHOUT_TEXT  [1X01_WITHOUT_TEXT]
JP293  M01PTH_WITHOUT_TEXT  [1X01_WITHOUT_TEXT]
JP294  M01PTH_WITHOUT_TEXT  [1X01_WITHOUT_TEXT]
JP295  M01PTH_WITHOUT_TEXT  [1X01_WITHOUT_TEXT]
JP296  M01PTH_WITHOUT_TEXT  [1X01_WITHOUT_TEXT]
JP297  M01PTH_WITHOUT_TEXT  [1X01_WITHOUT_TEXT]
JP298  M01PTH_WITHOUT_TEXT  [1X01_WITHOUT_TEXT]
JP299  M01PTH_WITHOUT_TEXT  [1X01_WITHOUT_TEXT]
JP300  M01PTH_WITHOUT_TEXT  [1X01_WITHOUT_TEXT]
JP301  M01PTH_WITHOUT_TEXT  [1X01_WITHOUT_TEXT]
JP302  M01PTH_WITHOUT_TEXT  [1X01_WITHOUT_TEXT]
JP303  M01PTH_WITHOUT_TEXT  [1X01_WITHOUT_TEXT]
JP304  M01PTH_WITHOUT_TEXT  [1X01_WITHOUT_TEXT]
JP305  M01PTH_WITHOUT_TEXT  [1X01_WITHOUT_TEXT]
JP306  M01PTH_WITHOUT_TEXT  [1X01_WITHOUT_TEXT]
JP307  M01PTH_WITHOUT_TEXT  [1X01_WITHOUT_TEXT]
JP308  M01PTH_WITHOUT_TEXT  [1X01_WITHOUT_TEXT]
JP309  M01PTH_WITHOUT_TEXT  [1X01_WITHOUT_TEXT]
JP310  M01PTH_WITHOUT_TEXT  [1X01_WITHOUT_TEXT]
JP311  M01PTH_WITHOUT_TEXT  [1X01_WITHOUT_TEXT]
JP312  M01PTH_WITHOUT_TEXT  [1X01_WITHOUT_TEXT]
JP313  M01PTH_WITHOUT_TEXT  [1X01_WITHOUT_TEXT]
JP314  M01PTH_WITHOUT_TEXT  [1X01_WITHOUT_TEXT]
JP315  M01PTH_WITHOUT_TEXT  [1X01_WITHOUT_TEXT]
JP316  M01PTH_WITHOUT_TEXT  [1X01_WITHOUT_TEXT]
JP317  M01PTH_WITHOUT_TEXT  [1X01_WITHOUT_TEXT]
JP318  M01PTH_WITHOUT_TEXT  [1X01_WITHOUT_TEXT]
JP319  M01PTH_WITHOUT_TEXT  [1X01_WITHOUT_TEXT]
JP320  M01PTH_WITHOUT_TEXT  [1X01_WITHOUT_TEXT]
JP321  M01PTH_WITHOUT_TEXT  [1X01_WITHOUT_TEXT]
JP322  M01PTH_WITHOUT_TEXT  [1X01_WITHOUT_TEXT]
JP323  M01PTH_WITHOUT_TEXT  [1X01_WITHOUT_TEXT]
JP324  M01PTH_WITHOUT_TEXT  [1X01_WITHOUT_TEXT]
JP325  M01PTH_WITHOUT_TEXT  [1X01_WITHOUT_TEXT]
JP326  M01PTH_WITHOUT_TEXT  [1X01_WITHOUT_TEXT]
JP327  M01PTH_WITHOUT_TEXT  [1X01_WITHOUT_TEXT]
JP328  M01PTH_WITHOUT_TEXT  [1X01_WITHOUT_TEXT]
JP329  M01PTH_WITHOUT_TEXT  [1X01_WITHOUT_TEXT]
JP330  M01PTH_WITHOUT_TEXT  [1X01_WITHOUT_TEXT]
JP331  M01PTH_WITHOUT_TEXT  [1X01_WITHOUT_TEXT]
JP332  M01PTH_WITHOUT_TEXT  [1X01_WITHOUT_TEXT]
JP333  M01PTH_WITHOUT_TEXT  [1X01_WITHOUT_TEXT]
JP334  M01PTH_WITHOUT_TEXT  [1X01_WITHOUT_TEXT]
JP335  M01PTH_WITHOUT_TEXT  [1X01_WITHOUT_TEXT]
JP336  M01PTH_WITHOUT_TEXT  [1X01_WITHOUT_TEXT]
JP337  M01PTH_WITHOUT_TEXT  [1X01_WITHOUT_TEXT]
JP338  M01PTH_WITHOUT_TEXT  [1X01_WITHOUT_TEXT]
JP339  M01PTH_WITHOUT_TEXT  [1X01_WITHOUT_TEXT]
JP340  M01PTH_WITHOUT_TEXT  [1X01_WITHOUT_TEXT]
JP341  M01PTH_WITHOUT_TEXT  [1X01_WITHOUT_TEXT]
JP342  M01PTH_WITHOUT_TEXT  [1X01_WITHOUT_TEXT]
JP343  M01PTH_WITHOUT_TEXT  [1X01_WITHOUT_TEXT]
JP344  M01PTH_WITHOUT_TEXT  [1X01_WITHOUT_TEXT]
JP345  M01PTH_WITHOUT_TEXT  [1X01_WITHOUT_TEXT]
JP346  M01PTH_WITHOUT_TEXT  [1X01_WITHOUT_TEXT]
JP347  M01PTH_WITHOUT_TEXT  [1X01_WITHOUT_TEXT]
JP348  M01PTH_WITHOUT_TEXT  [1X01_WITHOUT_TEXT]
JP349  M01PTH_WITHOUT_TEXT  [1X01_WITHOUT_TEXT]
JP350  M01PTH_WITHOUT_TEXT  [1X01_WITHOUT_TEXT]
JP351  M01PTH_WITHOUT_TEXT  [1X01_WITHOUT_TEXT]
JP352  M01PTH_WITHOUT_TEXT  [1X01_WITHOUT_TEXT]
JP353  M01PTH_WITHOUT_TEXT  [1X01_WITHOUT_TEXT]
JP354  M01PTH_WITHOUT_TEXT  [1X01_WITHOUT_TEXT]
JP355  M01PTH_WITHOUT_TEXT  [1X01_WITHOUT_TEXT]
JP356  M01PTH_WITHOUT_TEXT  [1X01_WITHOUT_TEXT]
JP357  M01PTH_WITHOUT_TEXT  [1X01_WITHOUT_TEXT]
JP358  M01PTH_WITHOUT_TEXT  [1X01_WITHOUT_TEXT]
JP359  M01PTH_WITHOUT_TEXT  [1X01_WITHOUT_TEXT]
JP360  M01PTH_WITHOUT_TEXT  [1X01_WITHOUT_TEXT]
JP361  M01PTH_WITHOUT_TEXT  [1X01_WITHOUT_TEXT]
JP362  M01PTH_WITHOUT_TEXT  [1X01_WITHOUT_TEXT]
JP363  M01PTH_WITHOUT_TEXT  [1X01_WITHOUT_TEXT]
JP364  M01PTH_WITHOUT_TEXT  [1X01_WITHOUT_TEXT]
JP365  M01PTH_WITHOUT_TEXT  [1X01_WITHOUT_TEXT]
JP366  M01PTH_WITHOUT_TEXT  [1X01_WITHOUT_TEXT]
JP367  M01PTH_WITHOUT_TEXT  [1X01_WITHOUT_TEXT]
JP368  M01PTH_WITHOUT_TEXT  [1X01_WITHOUT_TEXT]
JP369  M01PTH_WITHOUT_TEXT  [1X01_WITHOUT_TEXT]
JP370  M01PTH_WITHOUT_TEXT  [1X01_WITHOUT_TEXT]
JP371  M01PTH_WITHOUT_TEXT  [1X01_WITHOUT_TEXT]
JP372  M01PTH_WITHOUT_TEXT  [1X01_WITHOUT_TEXT]
JP373  M01PTH_WITHOUT_TEXT  [1X01_WITHOUT_TEXT]
JP374  M01PTH_WITHOUT_TEXT  [1X01_WITHOUT_TEXT]
JP375  M01PTH_WITHOUT_TEXT  [1X01_WITHOUT_TEXT]
JP376  M01PTH_WITHOUT_TEXT  [1X01_WITHOUT_TEXT]
JP377  M01PTH_WITHOUT_TEXT  [1X01_WITHOUT_TEXT]
JP378  M01PTH_WITHOUT_TEXT  [1X01_WITHOUT_TEXT]
JP379  M01PTH_WITHOUT_TEXT  [1X01_WITHOUT_TEXT]
JP380  M01PTH_WITHOUT_TEXT  [1X01_WITHOUT_TEXT]
JP381  M01PTH_WITHOUT_TEXT  [1X01_WITHOUT_TEXT]
JP382  M01PTH_WITHOUT_TEXT  [1X01_WITHOUT_TEXT]
JP383  M01PTH_WITHOUT_TEXT  [1X01_WITHOUT_TEXT]
JP384  M01PTH_WITHOUT_TEXT  [1X01_WITHOUT_TEXT]
JP385  M01PTH_WITHOUT_TEXT  [1X01_WITHOUT_TEXT]
JP386  M01PTH_WITHOUT_TEXT  [1X01_WITHOUT_TEXT]
JP387  M01PTH_WITHOUT_TEXT  [1X01_WITHOUT_TEXT]
JP388  M01PTH_WITHOUT_TEXT  [1X01_WITHOUT_TEXT]
JP389  M01PTH_WITHOUT_TEXT  [1X01_WITHOUT_TEXT]
JP390  M01PTH_WITHOUT_TEXT  [1X01_WITHOUT_TEXT]
JP391  M01PTH_WITHOUT_TEXT  [1X01_WITHOUT_TEXT]
JP392  M01PTH_WITHOUT_TEXT  [1X01_WITHOUT_TEXT]
JP393  M01PTH_WITHOUT_TEXT  [1X01_WITHOUT_TEXT]
JP394  M01PTH_WITHOUT_TEXT  [1X01_WITHOUT_TEXT]
JP395  M01PTH_WITHOUT_TEXT  [1X01_WITHOUT_TEXT]
JP396  M01PTH_WITHOUT_TEXT  [1X01_WITHOUT_TEXT]
JP397  M01PTH_WITHOUT_TEXT  [1X01_WITHOUT_TEXT]
JP398  M01PTH_WITHOUT_TEXT  [1X01_WITHOUT_TEXT]
JP399  M01PTH_WITHOUT_TEXT  [1X01_WITHOUT_TEXT]
JP400  M01PTH_WITHOUT_TEXT  [1X01_WITHOUT_TEXT]
JP401  M01PTH_WITHOUT_TEXT  [1X01_WITHOUT_TEXT]
JP402  M01PTH_WITHOUT_TEXT  [1X01_WITHOUT_TEXT]
JP403  M01PTH_WITHOUT_TEXT  [1X01_WITHOUT_TEXT]
JP404  M01PTH_WITHOUT_TEXT  [1X01_WITHOUT_TEXT]
JP405  M01PTH_WITHOUT_TEXT  [1X01_WITHOUT_TEXT]
JP406  M01PTH_WITHOUT_TEXT  [1X01_WITHOUT_TEXT]
JP407  M01PTH_WITHOUT_TEXT  [1X01_WITHOUT_TEXT]
JP408  M01PTH_WITHOUT_TEXT  [1X01_WITHOUT_TEXT]
JP409  M01PTH_WITHOUT_TEXT  [1X01_WITHOUT_TEXT]
JP410  M01PTH_WITHOUT_TEXT  [1X01_WITHOUT_TEXT]
JP411  M01PTH_WITHOUT_TEXT  [1X01_WITHOUT_TEXT]
JP412  M01PTH_WITHOUT_TEXT  [1X01_WITHOUT_TEXT]
JP413  M01PTH_WITHOUT_TEXT  [1X01_WITHOUT_TEXT]
JP414  M01PTH_WITHOUT_TEXT  [1X01_WITHOUT_TEXT]
JP415  M01PTH_WITHOUT_TEXT  [1X01_WITHOUT_TEXT]
JP416  M01PTH_WITHOUT_TEXT  [1X01_WITHOUT_TEXT]
JP417  M01PTH_WITHOUT_TEXT  [1X01_WITHOUT_TEXT]
JP418  M01PTH_WITHOUT_TEXT  [1X01_WITHOUT_TEXT]
JP419  M01PTH_WITHOUT_TEXT  [1X01_WITHOUT_TEXT]
JP420  M01PTH_WITHOUT_TEXT  [1X01_WITHOUT_TEXT]
JP421  M01PTH_WITHOUT_TEXT  [1X01_WITHOUT_TEXT]
JP422  M01PTH_WITHOUT_TEXT  [1X01_WITHOUT_TEXT]
JP423  M01PTH_WITHOUT_TEXT  [1X01_WITHOUT_TEXT]
JP424  M01PTH_WITHOUT_TEXT  [1X01_WITHOUT_TEXT]
JP425  M01PTH_WITHOUT_TEXT  [1X01_WITHOUT_TEXT]
JP426  M01PTH_WITHOUT_TEXT  [1X01_WITHOUT_TEXT]
JP427  M01PTH_WITHOUT_TEXT  [1X01_WITHOUT_TEXT]
JP428  M01PTH_WITHOUT_TEXT  [1X01_WITHOUT_TEXT]
JP429  M01PTH_WITHOUT_TEXT  [1X01_WITHOUT_TEXT]
JP430  M01PTH_WITHOUT_TEXT  [1X01_WITHOUT_TEXT]
JP431  M01PTH_WITHOUT_TEXT  [1X01_WITHOUT_TEXT]
JP432  M01PTH_WITHOUT_TEXT  [1X01_WITHOUT_TEXT]
JP433  M01PTH_WITHOUT_TEXT  [1X01_WITHOUT_TEXT]
JP434  M01PTH_WITHOUT_TEXT  [1X01_WITHOUT_TEXT]
JP435  M01PTH_WITHOUT_TEXT  [1X01_WITHOUT_TEXT]
JP436  M01PTH_WITHOUT_TEXT  [1X01_WITHOUT_TEXT]
JP437  M01PTH_WITHOUT_TEXT  [1X01_WITHOUT_TEXT]
JP438  M01PTH_WITHOUT_TEXT  [1X01_WITHOUT_TEXT]
JP439  M01PTH_WITHOUT_TEXT  [1X01_WITHOUT_TEXT]
JP440  M01PTH_WITHOUT_TEXT  [1X01_WITHOUT_TEXT]
JP441  M01PTH_WITHOUT_TEXT  [1X01_WITHOUT_TEXT]
JP442  M01PTH_WITHOUT_TEXT  [1X01_WITHOUT_TEXT]
JP443  M01PTH_WITHOUT_TEXT  [1X01_WITHOUT_TEXT]
JP444  M01PTH_WITHOUT_TEXT  [1X01_WITHOUT_TEXT]
JP445  M01PTH_WITHOUT_TEXT  [1X01_WITHOUT_TEXT]
JP446  M01PTH_WITHOUT_TEXT  [1X01_WITHOUT_TEXT]
JP447  M01PTH_WITHOUT_TEXT  [1X01_WITHOUT_TEXT]
JP448  M01PTH_WITHOUT_TEXT  [1X01_WITHOUT_TEXT]
JP449  M01PTH_WITHOUT_TEXT  [1X01_WITHOUT_TEXT]
JP450  M01PTH_WITHOUT_TEXT  [1X01_WITHOUT_TEXT]
JP451  M01PTH_WITHOUT_TEXT  [1X01_WITHOUT_TEXT]
JP452  M01PTH_WITHOUT_TEXT  [1X01_WITHOUT_TEXT]
JP453  M01PTH_WITHOUT_TEXT  [1X01_WITHOUT_TEXT]
JP454  M01PTH_WITHOUT_TEXT  [1X01_WITHOUT_TEXT]
JP455  M01PTH_WITHOUT_TEXT  [1X01_WITHOUT_TEXT]
JP456  M01PTH_WITHOUT_TEXT  [1X01_WITHOUT_TEXT]
JP457  M01PTH_WITHOUT_TEXT  [1X01_WITHOUT_TEXT]
JP458  M01PTH_WITHOUT_TEXT  [1X01_WITHOUT_TEXT]
JP459  M01PTH_WITHOUT_TEXT  [1X01_WITHOUT_TEXT]
JP460  M01PTH_WITHOUT_TEXT  [1X01_WITHOUT_TEXT]
JP461  M01PTH_WITHOUT_TEXT  [1X01_WITHOUT_TEXT]
JP462  M01PTH_WITHOUT_TEXT  [1X01_WITHOUT_TEXT]
JP463  M01PTH_WITHOUT_TEXT  [1X01_WITHOUT_TEXT]
JP464  M01PTH_WITHOUT_TEXT  [1X01_WITHOUT_TEXT]
JP465  M01PTH_WITHOUT_TEXT  [1X01_WITHOUT_TEXT]
JP466  M01PTH_WITHOUT_TEXT  [1X01_WITHOUT_TEXT]
JP467  M01PTH_WITHOUT_TEXT  [1X01_WITHOUT_TEXT]
JP468  M01PTH_WITHOUT_TEXT  [1X01_WITHOUT_TEXT]
JP469  M01PTH_WITHOUT_TEXT  [1X01_WITHOUT_TEXT]
JP470  M01PTH_WITHOUT_TEXT  [1X01_WITHOUT_TEXT]
JP471  M01PTH_WITHOUT_TEXT  [1X01_WITHOUT_TEXT]
JP472  M01PTH_WITHOUT_TEXT  [1X01_WITHOUT_TEXT]
JP473  M01PTH_WITHOUT_TEXT  [1X01_WITHOUT_TEXT]
JP474  M01PTH_WITHOUT_TEXT  [1X01_WITHOUT_TEXT]
JP475  M01PTH_WITHOUT_TEXT  [1X01_WITHOUT_TEXT]
JP476  M01PTH_WITHOUT_TEXT  [1X01_WITHOUT_TEXT]
JP477  M01PTH_WITHOUT_TEXT  [1X01_WITHOUT_TEXT]
JP478  M01PTH_WITHOUT_TEXT  [1X01_WITHOUT_TEXT]
JP479  M01PTH_WITHOUT_TEXT  [1X01_WITHOUT_TEXT]
JP480  M01PTH_WITHOUT_TEXT  [1X01_WITHOUT_TEXT]
JP481  M01PTH_WITHOUT_TEXT  [1X01_WITHOUT_TEXT]
JP482  M01PTH_WITHOUT_TEXT  [1X01_WITHOUT_TEXT]
JP483  M01PTH_WITHOUT_TEXT  [1X01_WITHOUT_TEXT]
JP484  M01PTH_WITHOUT_TEXT  [1X01_WITHOUT_TEXT]
JP485  M01PTH_WITHOUT_TEXT  [1X01_WITHOUT_TEXT]
JP486  M01PTH_WITHOUT_TEXT  [1X01_WITHOUT_TEXT]
JP487  M01PTH_WITHOUT_TEXT  [1X01_WITHOUT_TEXT]
JP488  M01PTH_WITHOUT_TEXT  [1X01_WITHOUT_TEXT]
JP489  M01PTH_WITHOUT_TEXT  [1X01_WITHOUT_TEXT]
JP490  M01PTH_WITHOUT_TEXT  [1X01_WITHOUT_TEXT]
JP491  M01PTH_WITHOUT_TEXT  [1X01_WITHOUT_TEXT]
JP492  M01PTH_WITHOUT_TEXT  [1X01_WITHOUT_TEXT]
JP493  M01PTH_WITHOUT_TEXT  [1X01_WITHOUT_TEXT]
JP494  M01PTH_WITHOUT_TEXT  [1X01_WITHOUT_TEXT]
JP495  M01PTH_WITHOUT_TEXT  [1X01_WITHOUT_TEXT]
JP496  M01PTH_WITHOUT_TEXT  [1X01_WITHOUT_TEXT]
JP497  M01PTH_WITHOUT_TEXT  [1X01_WITHOUT_TEXT]
JP498  M01PTH_WITHOUT_TEXT  [1X01_WITHOUT_TEXT]
JP499  M01PTH_WITHOUT_TEXT  [1X01_WITHOUT_TEXT]
JP500  M01PTH_WITHOUT_TEXT  [1X01_WITHOUT_TEXT]
JP501  M01PTH_WITHOUT_TEXT  [1X01_WITHOUT_TEXT]
JP502  M01PTH_WITHOUT_TEXT  [1X01_WITHOUT_TEXT]
JP503  M01PTH_WITHOUT_TEXT  [1X01_WITHOUT_TEXT]
JP504  M01PTH_WITHOUT_TEXT  [1X01_WITHOUT_TEXT]
JP505  M01PTH_WITHOUT_TEXT  [1X01_WITHOUT_TEXT]
JP506  M01PTH_WITHOUT_TEXT  [1X01_WITHOUT_TEXT]
JP507  M01PTH_WITHOUT_TEXT  [1X01_WITHOUT_TEXT]
JP508  M01PTH_WITHOUT_TEXT  [1X01_WITHOUT_TEXT]
JP509  M01PTH_WITHOUT_TEXT  [1X01_WITHOUT_TEXT]
JP510  M01PTH_WITHOUT_TEXT  [1X01_WITHOUT_TEXT]
JP511  M01PTH_WITHOUT_TEXT  [1X01_WITHOUT_TEXT]
JP512  M01PTH_WITHOUT_TEXT  [1X01_WITHOUT_TEXT]
JP513  M01PTH_WITHOUT_TEXT  [1X01_WITHOUT_TEXT]
JP514  M01PTH_WITHOUT_TEXT  [1X01_WITHOUT_TEXT]
JP515  M01PTH_WITHOUT_TEXT  [1X01_WITHOUT_TEXT]
JP516  M01PTH_WITHOUT_TEXT  [1X01_WITHOUT_TEXT]
JP517  M01PTH_WITHOUT_TEXT  [1X01_WITHOUT_TEXT]
JP518  M01PTH_WITHOUT_TEXT  [1X01_WITHOUT_TEXT]
JP519  M01PTH_WITHOUT_TEXT  [1X01_WITHOUT_TEXT]
JP520  M01PTH_WITHOUT_TEXT  [1X01_WITHOUT_TEXT]
JP521  M01PTH_WITHOUT_TEXT  [1X01_WITHOUT_TEXT]
JP522  M01PTH_WITHOUT_TEXT  [1X01_WITHOUT_TEXT]
JP523  M01PTH_WITHOUT_TEXT  [1X01_WITHOUT_TEXT]
JP524  M01PTH_WITHOUT_TEXT  [1X01_WITHOUT_TEXT]
JP525  M01PTH_WITHOUT_TEXT  [1X01_WITHOUT_TEXT]
JP526  M01PTH_WITHOUT_TEXT  [1X01_WITHOUT_TEXT]
JP527  M01PTH_WITHOUT_TEXT  [1X01_WITHOUT_TEXT]
JP528  M01PTH_WITHOUT_TEXT  [1X01_WITHOUT_TEXT]
JP529  M01PTH_WITHOUT_TEXT  [1X01_WITHOUT_TEXT]
JP530  M01PTH_WITHOUT_TEXT  [1X01_WITHOUT_TEXT]
JP531  M01PTH_WITHOUT_TEXT  [1X01_WITHOUT_TEXT]
JP532  M01PTH_WITHOUT_TEXT  [1X01_WITHOUT_TEXT]
JP533  M01PTH_WITHOUT_TEXT  [1X01_WITHOUT_TEXT]
JP534  M01PTH_WITHOUT_TEXT  [1X01_WITHOUT_TEXT]
JP535  M01PTH_WITHOUT_TEXT  [1X01_WITHOUT_TEXT]
JP536  M01PTH_WITHOUT_TEXT  [1X01_WITHOUT_TEXT]
JP537  M01PTH_WITHOUT_TEXT  [1X01_WITHOUT_TEXT]
JP538  M01PTH_WITHOUT_TEXT  [1X01_WITHOUT_TEXT]
JP539  M01PTH_WITHOUT_TEXT  [1X01_WITHOUT_TEXT]
JP540  M01PTH_WITHOUT_TEXT  [1X01_WITHOUT_TEXT]
JP541  M01PTH_WITHOUT_TEXT  [1X01_WITHOUT_TEXT]
JP542  M01PTH_WITHOUT_TEXT  [1X01_WITHOUT_TEXT]
JP543  M01PTH_WITHOUT_TEXT  [1X01_WITHOUT_TEXT]
JP544  M01PTH_WITHOUT_TEXT  [1X01_WITHOUT_TEXT]
JP545  M01PTH_WITHOUT_TEXT  [1X01_WITHOUT_TEXT]
JP546  M01PTH_WITHOUT_TEXT  [1X01_WITHOUT_TEXT]
JP547  M01PTH_WITHOUT_TEXT  [1X01_WITHOUT_TEXT]
JP548  M01PTH_WITHOUT_TEXT  [1X01_WITHOUT_TEXT]
JP549  M01PTH_WITHOUT_TEXT  [1X01_WITHOUT_TEXT]
JP550  M01PTH_WITHOUT_TEXT  [1X01_WITHOUT_TEXT]
JP551  M01PTH_WITHOUT_TEXT  [1X01_WITHOUT_TEXT]
JP552  M01PTH_WITHOUT_TEXT  [1X01_WITHOUT_TEXT]
JP553  M01PTH_WITHOUT_TEXT  [1X01_WITHOUT_TEXT]
JP554  M01PTH_WITHOUT_TEXT  [1X01_WITHOUT_TEXT]
JP555  M01PTH_WITHOUT_TEXT  [1X01_WITHOUT_TEXT]
JP556  M01PTH_WITHOUT_TEXT  [1X01_WITHOUT_TEXT]
JP557  M01PTH_WITHOUT_TEXT  [1X01_WITHOUT_TEXT]
JP558  M01PTH_WITHOUT_TEXT  [1X01_WITHOUT_TEXT]
JP559  M01PTH_WITHOUT_TEXT  [1X01_WITHOUT_TEXT]
JP560  M01PTH_WITHOUT_TEXT  [1X01_WITHOUT_TEXT]
JP561  M01PTH_WITHOUT_TEXT  [1X01_WITHOUT_TEXT]
JP562  M01PTH_WITHOUT_TEXT  [1X01_WITHOUT_TEXT]
JP563  M01PTH_WITHOUT_TEXT  [1X01_WITHOUT_TEXT]
JP564  M01PTH_WITHOUT_TEXT  [1X01_WITHOUT_TEXT]
JP565  M01PTH_WITHOUT_TEXT  [1X01_WITHOUT_TEXT]
JP566  M01PTH_WITHOUT_TEXT  [1X01_WITHOUT_TEXT]
JP567  M01PTH_WITHOUT_TEXT  [1X01_WITHOUT_TEXT]
JP568  M01PTH_WITHOUT_TEXT  [1X01_WITHOUT_TEXT]
JP569  M01PTH_WITHOUT_TEXT  [1X01_WITHOUT_TEXT]
JP570  M01PTH_WITHOUT_TEXT  [1X01_WITHOUT_TEXT]
JP571  M01PTH_WITHOUT_TEXT  [1X01_WITHOUT_TEXT]
JP572  M01PTH_WITHOUT_TEXT  [1X01_WITHOUT_TEXT]
JP573  M01PTH_WITHOUT_TEXT  [1X01_WITHOUT_TEXT]
JP574  M01PTH_WITHOUT_TEXT  [1X01_WITHOUT_TEXT]
JP575  M01PTH_WITHOUT_TEXT  [1X01_WITHOUT_TEXT]
JP576  M01PTH_WITHOUT_TEXT  [1X01_WITHOUT_TEXT]
JP577  M01PTH_WITHOUT_TEXT  [1X01_WITHOUT_TEXT]
JP578  M01PTH_WITHOUT_TEXT  [1X01_WITHOUT_TEXT]
JP579  M01PTH_WITHOUT_TEXT  [1X01_WITHOUT_TEXT]
JP580  M01PTH_WITHOUT_TEXT  [1X01_WITHOUT_TEXT]
JP581  M01PTH_WITHOUT_TEXT  [1X01_WITHOUT_TEXT]
JP582  M01PTH_WITHOUT_TEXT  [1X01_WITHOUT_TEXT]
JP583  M01PTH_WITHOUT_TEXT  [1X01_WITHOUT_TEXT]
JP584  M01PTH_WITHOUT_TEXT  [1X01_WITHOUT_TEXT]
JP585  M01PTH_WITHOUT_TEXT  [1X01_WITHOUT_TEXT]
JP586  M01PTH_WITHOUT_TEXT  [1X01_WITHOUT_TEXT]
JP587  M01PTH_WITHOUT_TEXT  [1X01_WITHOUT_TEXT]
JP588  M01PTH_WITHOUT_TEXT  [1X01_WITHOUT_TEXT]
JP589  M01PTH_WITHOUT_TEXT  [1X01_WITHOUT_TEXT]
JP590  M01PTH_WITHOUT_TEXT  [1X01_WITHOUT_TEXT]
JP591  M01PTH_WITHOUT_TEXT  [1X01_WITHOUT_TEXT]
JP592  M01PTH_WITHOUT_TEXT  [1X01_WITHOUT_TEXT]
JP593  M01PTH_WITHOUT_TEXT  [1X01_WITHOUT_TEXT]
JP594  M01PTH_WITHOUT_TEXT  [1X01_WITHOUT_TEXT]
JP595  M01PTH_WITHOUT_TEXT  [1X01_WITHOUT_TEXT]
JP596  M01PTH_WITHOUT_TEXT  [1X01_WITHOUT_TEXT]
JP597  M01PTH_WITHOUT_TEXT  [1X01_WITHOUT_TEXT]
JP598  M01PTH_WITHOUT_TEXT  [1X01_WITHOUT_TEXT]
JP599  M01PTH_WITHOUT_TEXT  [1X01_WITHOUT_TEXT]
JP600  M01PTH_WITHOUT_TEXT  [1X01_WITHOUT_TEXT]
JP601  M01PTH_SMD_3.25X0.85MM_NO_SILK  [1X01_SMD_3.25X0.85MM_NO_SILK]
JP602  M01PTH_SMD_3.25X0.85MM_NO_SILK  [1X01_SMD_3.25X0.85MM_NO_SILK]
JP603  M01PTH_SMD_3.25X0.85MM_NO_SILK  [1X01_SMD_3.25X0.85MM_NO_SILK]
JP604  M01PTH_SMD_3.25X0.85MM_NO_SILK  [1X01_SMD_3.25X0.85MM_NO_SILK]
JP605  M01PTH_SMD_3.25X0.85MM_NO_SILK  [1X01_SMD_3.25X0.85MM_NO_SILK]
JP606  M01PTH_SMD_3.25X0.85MM_NO_SILK  [1X01_SMD_3.25X0.85MM_NO_SILK]
JP607  M01PTH_SMD_3.25X0.85MM_NO_SILK  [1X01_SMD_3.25X0.85MM_NO_SILK]
JP608  M01PTH_SMD_3.25X0.85MM_NO_SILK  [1X01_SMD_3.25X0.85MM_NO_SILK]
JP609  M01PTH_SMD_3.25X0.85MM_NO_SILK  [1X01_SMD_3.25X0.85MM_NO_SILK]
JP610  M01PTH_SMD_3.25X0.85MM_NO_SILK  [1X01_SMD_3.25X0.85MM_NO_SILK]
JP611  M01PTH_SMD_3.25X0.85MM_NO_SILK  [1X01_SMD_3.25X0.85MM_NO_SILK]
JP612  M01PTH_SMD_3.25X0.85MM_NO_SILK  [1X01_SMD_3.25X0.85MM_NO_SILK]
JP613  M01PTH_SMD_3.25X0.85MM_NO_SILK  [1X01_SMD_3.25X0.85MM_NO_SILK]
JP614  M01PTH_SMD_3.25X0.85MM_NO_SILK  [1X01_SMD_3.25X0.85MM_NO_SILK]
JP615  M01PTH_SMD_3.25X0.85MM_NO_SILK  [1X01_SMD_3.25X0.85MM_NO_SILK]
JP616  M01PTH_SMD_3.25X0.85MM_NO_SILK  [1X01_SMD_3.25X0.85MM_NO_SILK]
JP617  M01PTH_SMD_3.25X0.85MM_NO_SILK  [1X01_SMD_3.25X0.85MM_NO_SILK]
JP618  M01PTH_SMD_3.25X0.85MM_NO_SILK  [1X01_SMD_3.25X0.85MM_NO_SILK]
JP619  M01PTH_SMD_3.25X0.85MM_NO_SILK  [1X01_SMD_3.25X0.85MM_NO_SILK]
JP620  M01PTH_SMD_3.25X0.85MM_NO_SILK  [1X01_SMD_3.25X0.85MM_NO_SILK]
JP621  M01PTH_SMD_3.25X0.85MM_NO_SILK  [1X01_SMD_3.25X0.85MM_NO_SILK]
JP622  M01PTH_SMD_3.25X0.85MM_NO_SILK  [1X01_SMD_3.25X0.85MM_NO_SILK]
JP623  M01PTH_SMD_3.25X0.85MM_NO_SILK  [1X01_SMD_3.25X0.85MM_NO_SILK]
JP624  M01PTH_SMD_3.25X0.85MM_NO_SILK  [1X01_SMD_3.25X0.85MM_NO_SILK]
JP625  M01PTH_SMD_3.25X0.85MM_NO_SILK  [1X01_SMD_3.25X0.85MM_NO_SILK]
JP626  M01PTH_SMD_3.25X0.85MM_NO_SILK  [1X01_SMD_3.25X0.85MM_NO_SILK]
JP627  M01PTH_SMD_3.25X0.85MM_NO_SILK  [1X01_SMD_3.25X0.85MM_NO_SILK]
JP628  M01PTH_SMD_3.25X0.85MM_NO_SILK  [1X01_SMD_3.25X0.85MM_NO_SILK]
JP629  M01PTH_SMD_3.25X0.85MM_NO_SILK  [1X01_SMD_3.25X0.85MM_NO_SILK]
JP630  M01PTH_SMD_3.25X0.85MM_NO_SILK  [1X01_SMD_3.25X0.85MM_NO_SILK]
JP631  M01PTH_SMD_3.25X0.85MM_NO_SILK  [1X01_SMD_3.25X0.85MM_NO_SILK]
JP632  M01PTH_SMD_3.25X0.85MM_NO_SILK  [1X01_SMD_3.25X0.85MM_NO_SILK]
JP633  M01PTH_SMD_3.25X0.85MM_NO_SILK  [1X01_SMD_3.25X0.85MM_NO_SILK]
JP634  M01PTH_SMD_3.25X0.85MM_NO_SILK  [1X01_SMD_3.25X0.85MM_NO_SILK]
JP635  M01PTH_SMD_3.25X0.85MM_NO_SILK  [1X01_SMD_3.25X0.85MM_NO_SILK]
JP636  M01PTH_SMD_3.25X0.85MM_NO_SILK  [1X01_SMD_3.25X0.85MM_NO_SILK]
JP637  M01PTH_SMD_3.25X0.85MM_NO_SILK  [1X01_SMD_3.25X0.85MM_NO_SILK]
JP638  M01PTH_SMD_3.25X0.85MM_NO_SILK  [1X01_SMD_3.25X0.85MM_NO_SILK]
JP639  M01PTH_SMD_3.25X0.85MM_NO_SILK  [1X01_SMD_3.25X0.85MM_NO_SILK]
JP640  M01PTH_SMD_3.25X0.85MM_NO_SILK  [1X01_SMD_3.25X0.85MM_NO_SILK]
JP641  M01PTH_SMD_3.25X0.85MM_NO_SILK  [1X01_SMD_3.25X0.85MM_NO_SILK]
JP642  M01PTH_SMD_3.25X0.85MM_NO_SILK  [1X01_SMD_3.25X0.85MM_NO_SILK]
JP643  M01PTH_SMD_3.25X0.85MM_NO_SILK  [1X01_SMD_3.25X0.85MM_NO_SILK]
JP644  M01PTH_SMD_3.25X0.85MM_NO_SILK  [1X01_SMD_3.25X0.85MM_NO_SILK]
JP645  M01PTH_SMD_3.25X0.85MM_NO_SILK  [1X01_SMD_3.25X0.85MM_NO_SILK]
JP646  M01PTH_SMD_3.25X0.85MM_NO_SILK  [1X01_SMD_3.25X0.85MM_NO_SILK]
JP647  M01PTH_SMD_3.25X0.85MM_NO_SILK  [1X01_SMD_3.25X0.85MM_NO_SILK]
JP648  M01PTH_SMD_3.25X0.85MM_NO_SILK  [1X01_SMD_3.25X0.85MM_NO_SILK]
JP649  M01PTH_SMD_3.25X0.85MM_NO_SILK  [1X01_SMD_3.25X0.85MM_NO_SILK]
JP650  M01PTH_SMD_3.25X0.85MM_NO_SILK  [1X01_SMD_3.25X0.85MM_NO_SILK]
JP651  M01PTH_SMD_3.25X0.85MM_NO_SILK  [1X01_SMD_3.25X0.85MM_NO_SILK]
JP652  M01PTH_SMD_3.25X0.85MM_NO_SILK  [1X01_SMD_3.25X0.85MM_NO_SILK]
JP653  M01PTH_SMD_3.25X0.85MM_NO_SILK  [1X01_SMD_3.25X0.85MM_NO_SILK]
JP654  M01PTH_SMD_3.25X0.85MM_NO_SILK  [1X01_SMD_3.25X0.85MM_NO_SILK]
JP655  M01PTH_SMD_3.25X0.85MM_NO_SILK  [1X01_SMD_3.25X0.85MM_NO_SILK]
JP656  M01PTH_SMD_3.25X0.85MM_NO_SILK  [1X01_SMD_3.25X0.85MM_NO_SILK]
JP657  M01PTH_SMD_3.25X0.85MM_NO_SILK  [1X01_SMD_3.25X0.85MM_NO_SILK]
JP658  M01PTH_SMD_3.25X0.85MM_NO_SILK  [1X01_SMD_3.25X0.85MM_NO_SILK]
JP659  M01PTH_SMD_3.25X0.85MM_NO_SILK  [1X01_SMD_3.25X0.85MM_NO_SILK]
JP660  M01PTH_SMD_3.25X0.85MM_NO_SILK  [1X01_SMD_3.25X0.85MM_NO_SILK]
JP661  M01PTH_SMD_3.25X0.85MM_NO_SILK  [1X01_SMD_3.25X0.85MM_NO_SILK]
JP662  M01PTH_SMD_3.25X0.85MM_NO_SILK  [1X01_SMD_3.25X0.85MM_NO_SILK]
JP663  M01PTH_SMD_3.25X0.85MM_NO_SILK  [1X01_SMD_3.25X0.85MM_NO_SILK]
JP664  M01PTH_SMD_3.25X0.85MM_NO_SILK  [1X01_SMD_3.25X0.85MM_NO_SILK]
JP665  M01PTH_SMD_3.25X0.85MM_NO_SILK  [1X01_SMD_3.25X0.85MM_NO_SILK]
JP666  M01PTH_SMD_3.25X0.85MM_NO_SILK  [1X01_SMD_3.25X0.85MM_NO_SILK]
JP667  M01PTH_SMD_3.25X0.85MM_NO_SILK  [1X01_SMD_3.25X0.85MM_NO_SILK]
JP668  M01PTH_SMD_3.25X0.85MM_NO_SILK  [1X01_SMD_3.25X0.85MM_NO_SILK]
JP669  M01PTH_SMD_3.25X0.85MM_NO_SILK  [1X01_SMD_3.25X0.85MM_NO_SILK]
JP670  M01PTH_SMD_3.25X0.85MM_NO_SILK  [1X01_SMD_3.25X0.85MM_NO_SILK]
JP671  M01PTH_SMD_3.25X0.85MM_NO_SILK  [1X01_SMD_3.25X0.85MM_NO_SILK]
JP672  M01PTH_SMD_3.25X0.85MM_NO_SILK  [1X01_SMD_3.25X0.85MM_NO_SILK]
JP673  M01PTH_SMD_3.25X0.85MM_NO_SILK  [1X01_SMD_3.25X0.85MM_NO_SILK]
JP674  M01PTH_SMD_3.25X0.85MM_NO_SILK  [1X01_SMD_3.25X0.85MM_NO_SILK]
JP675  M01PTH_SMD_3.25X0.85MM_NO_SILK  [1X01_SMD_3.25X0.85MM_NO_SILK]
JP676  M01PTH_SMD_3.25X0.85MM_NO_SILK  [1X01_SMD_3.25X0.85MM_NO_SILK]
JP677  M01PTH_SMD_3.25X0.85MM_NO_SILK  [1X01_SMD_3.25X0.85MM_NO_SILK]
JP678  M01PTH_SMD_3.25X0.85MM_NO_SILK  [1X01_SMD_3.25X0.85MM_NO_SILK]
JP679  M01PTH_SMD_3.25X0.85MM_NO_SILK  [1X01_SMD_3.25X0.85MM_NO_SILK]
JP680  M01PTH_SMD_3.25X0.85MM_NO_SILK  [1X01_SMD_3.25X0.85MM_NO_SILK]
JP681  M01PTH_SMD_3.25X0.85MM_NO_SILK  [1X01_SMD_3.25X0.85MM_NO_SILK]
JP682  M01PTH_SMD_3.25X0.85MM_NO_SILK  [1X01_SMD_3.25X0.85MM_NO_SILK]
JP683  M01PTH_SMD_3.25X0.85MM_NO_SILK  [1X01_SMD_3.25X0.85MM_NO_SILK]
JP684  M01PTH_SMD_3.25X0.85MM_NO_SILK  [1X01_SMD_3.25X0.85MM_NO_SILK]
JP685  M01PTH_SMD_3.25X0.85MM_NO_SILK  [1X01_SMD_3.25X0.85MM_NO_SILK]
JP686  M01PTH_SMD_3.25X0.85MM_NO_SILK  [1X01_SMD_3.25X0.85MM_NO_SILK]
JP687  M01PTH_SMD_3.25X0.85MM_NO_SILK  [1X01_SMD_3.25X0.85MM_NO_SILK]
JP688  M01PTH_SMD_3.25X0.85MM_NO_SILK  [1X01_SMD_3.25X0.85MM_NO_SILK]
JP689  M01PTH_SMD_3.25X0.85MM_NO_SILK  [1X01_SMD_3.25X0.85MM_NO_SILK]
JP690  M01PTH_SMD_3.25X0.85MM_NO_SILK  [1X01_SMD_3.25X0.85MM_NO_SILK]
JP691  M01PTH_SMD_3.25X0.85MM_NO_SILK  [1X01_SMD_3.25X0.85MM_NO_SILK]
JP692  M01PTH_SMD_3.25X0.85MM_NO_SILK  [1X01_SMD_3.25X0.85MM_NO_SILK]
JP693  M01PTH_SMD_3.25X0.85MM_NO_SILK  [1X01_SMD_3.25X0.85MM_NO_SILK]
JP694  M01PTH_SMD_3.25X0.85MM_NO_SILK  [1X01_SMD_3.25X0.85MM_NO_SILK]
JP695  M01PTH_SMD_3.25X0.85MM_NO_SILK  [1X01_SMD_3.25X0.85MM_NO_SILK]
JP696  M01PTH_SMD_3.25X0.85MM_NO_SILK  [1X01_SMD_3.25X0.85MM_NO_SILK]
JP697  M01PTH_SMD_3.25X0.85MM_NO_SILK  [1X01_SMD_3.25X0.85MM_NO_SILK]
JP698  M01PTH_SMD_3.25X0.85MM_NO_SILK  [1X01_SMD_3.25X0.85MM_NO_SILK]
JP699  M01PTH_SMD_3.25X0.85MM_NO_SILK  [1X01_SMD_3.25X0.85MM_NO_SILK]
JP700  M01PTH_SMD_3.25X0.85MM_NO_SILK  [1X01_SMD_3.25X0.85MM_NO_SILK]
JP701  M01PTH_SMD_3.25X0.85MM_NO_SILK  [1X01_SMD_3.25X0.85MM_NO_SILK]
JP702  M01PTH_SMD_3.25X0.85MM_NO_SILK  [1X01_SMD_3.25X0.85MM_NO_SILK]
JP703  M01PTH_SMD_3.25X0.85MM_NO_SILK  [1X01_SMD_3.25X0.85MM_NO_SILK]
JP704  M01PTH_SMD_3.25X0.85MM_NO_SILK  [1X01_SMD_3.25X0.85MM_NO_SILK]
JP705  M01PTH_SMD_3.25X0.85MM_NO_SILK  [1X01_SMD_3.25X0.85MM_NO_SILK]
JP706  M01PTH_SMD_3.25X0.85MM_NO_SILK  [1X01_SMD_3.25X0.85MM_NO_SILK]
JP707  M01PTH_SMD_3.25X0.85MM_NO_SILK  [1X01_SMD_3.25X0.85MM_NO_SILK]
JP708  M01PTH_SMD_3.25X0.85MM_NO_SILK  [1X01_SMD_3.25X0.85MM_NO_SILK]
JP709  M01PTH_SMD_3.25X0.85MM_NO_SILK  [1X01_SMD_3.25X0.85MM_NO_SILK]
JP710  M01PTH_SMD_3.25X0.85MM_NO_SILK  [1X01_SMD_3.25X0.85MM_NO_SILK]
JP711  M01PTH_SMD_3.25X0.85MM_NO_SILK  [1X01_SMD_3.25X0.85MM_NO_SILK]
JP712  M01PTH_SMD_3.25X0.85MM_NO_SILK  [1X01_SMD_3.25X0.85MM_NO_SILK]
JP713  M01PTH_SMD_3.25X0.85MM_NO_SILK  [1X01_SMD_3.25X0.85MM_NO_SILK]
JP714  M01PTH_SMD_3.25X0.85MM_NO_SILK  [1X01_SMD_3.25X0.85MM_NO_SILK]
JP715  M01PTH_SMD_3.25X0.85MM_NO_SILK  [1X01_SMD_3.25X0.85MM_NO_SILK]
JP716  M01PTH_SMD_3.25X0.85MM_NO_SILK  [1X01_SMD_3.25X0.85MM_NO_SILK]
JP717  M01PTH_SMD_3.25X0.85MM_NO_SILK  [1X01_SMD_3.25X0.85MM_NO_SILK]
JP718  M01PTH_SMD_3.25X0.85MM_NO_SILK  [1X01_SMD_3.25X0.85MM_NO_SILK]
JP719  M01PTH_SMD_3.25X0.85MM_NO_SILK  [1X01_SMD_3.25X0.85MM_NO_SILK]
JP720  M01PTH_SMD_3.25X0.85MM_NO_SILK  [1X01_SMD_3.25X0.85MM_NO_SILK]
JP721  M01PTH_SMD_3.25X0.85MM_NO_SILK  [1X01_SMD_3.25X0.85MM_NO_SILK]
JP722  M01PTH_SMD_3.25X0.85MM_NO_SILK  [1X01_SMD_3.25X0.85MM_NO_SILK]
JP723  M01PTH_SMD_3.25X0.85MM_NO_SILK  [1X01_SMD_3.25X0.85MM_NO_SILK]
JP724  M01PTH_SMD_3.25X0.85MM_NO_SILK  [1X01_SMD_3.25X0.85MM_NO_SILK]
JP725  M01PTH_SMD_3.25X0.85MM_NO_SILK  [1X01_SMD_3.25X0.85MM_NO_SILK]
JP726  M01PTH_SMD_3.25X0.85MM_NO_SILK  [1X01_SMD_3.25X0.85MM_NO_SILK]
JP727  M01PTH_SMD_3.25X0.85MM_NO_SILK  [1X01_SMD_3.25X0.85MM_NO_SILK]
JP728  M01PTH_SMD_3.25X0.85MM_NO_SILK  [1X01_SMD_3.25X0.85MM_NO_SILK]
JP729  M01PTH_SMD_3.25X0.85MM_NO_SILK  [1X01_SMD_3.25X0.85MM_NO_SILK]
JP730  M01PTH_SMD_3.25X0.85MM_NO_SILK  [1X01_SMD_3.25X0.85MM_NO_SILK]
JP731  M01PTH_SMD_3.25X0.85MM_NO_SILK  [1X01_SMD_3.25X0.85MM_NO_SILK]
JP732  M01PTH_SMD_3.25X0.85MM_NO_SILK  [1X01_SMD_3.25X0.85MM_NO_SILK]
JP733  M01PTH_SMD_3.25X0.85MM_NO_SILK  [1X01_SMD_3.25X0.85MM_NO_SILK]
JP734  M01PTH_SMD_3.25X0.85MM_NO_SILK  [1X01_SMD_3.25X0.85MM_NO_SILK]
JP735  M01PTH_SMD_3.25X0.85MM_NO_SILK  [1X01_SMD_3.25X0.85MM_NO_SILK]
JP736  M01PTH_SMD_3.25X0.85MM_NO_SILK  [1X01_SMD_3.25X0.85MM_NO_SILK]
JP737  M01PTH_SMD_3.25X0.85MM_NO_SILK  [1X01_SMD_3.25X0.85MM_NO_SILK]
JP738  M01PTH_SMD_3.25X0.85MM_NO_SILK  [1X01_SMD_3.25X0.85MM_NO_SILK]
JP739  M01PTH_SMD_3.25X0.85MM_NO_SILK  [1X01_SMD_3.25X0.85MM_NO_SILK]
JP740  M01PTH_SMD_3.25X0.85MM_NO_SILK  [1X01_SMD_3.25X0.85MM_NO_SILK]
JP741  M01PTH_SMD_3.25X0.85MM_NO_SILK  [1X01_SMD_3.25X0.85MM_NO_SILK]
JP742  M01PTH_SMD_3.25X0.85MM_NO_SILK  [1X01_SMD_3.25X0.85MM_NO_SILK]
JP743  M01PTH_SMD_3.25X0.85MM_NO_SILK  [1X01_SMD_3.25X0.85MM_NO_SILK]
JP744  M01PTH_SMD_3.25X0.85MM_NO_SILK  [1X01_SMD_3.25X0.85MM_NO_SILK]
JP745  M01PTH_SMD_3.25X0.85MM_NO_SILK  [1X01_SMD_3.25X0.85MM_NO_SILK]
JP746  M01PTH_SMD_3.25X0.85MM_NO_SILK  [1X01_SMD_3.25X0.85MM_NO_SILK]
JP747  M01PTH_SMD_3.25X0.85MM_NO_SILK  [1X01_SMD_3.25X0.85MM_NO_SILK]
JP748  M01PTH_SMD_3.25X0.85MM_NO_SILK  [1X01_SMD_3.25X0.85MM_NO_SILK]
JP749  M01PTH_SMD_3.25X0.85MM_NO_SILK  [1X01_SMD_3.25X0.85MM_NO_SILK]
JP750  M01PTH_SMD_3.25X0.85MM_NO_SILK  [1X01_SMD_3.25X0.85MM_NO_SILK]
JP751  M01PTH_SMD_3.25X0.85MM_NO_SILK  [1X01_SMD_3.25X0.85MM_NO_SILK]
JP752  M01PTH_SMD_3.25X0.85MM_NO_SILK  [1X01_SMD_3.25X0.85MM_NO_SILK]
JP753  M01PTH_SMD_3.25X0.85MM_NO_SILK  [1X01_SMD_3.25X0.85MM_NO_SILK]
JP754  M01PTH_SMD_3.25X0.85MM_NO_SILK  [1X01_SMD_3.25X0.85MM_NO_SILK]
JP755  M01PTH_SMD_3.25X0.85MM_NO_SILK  [1X01_SMD_3.25X0.85MM_NO_SILK]
JP756  M01PTH_SMD_3.25X0.85MM_NO_SILK  [1X01_SMD_3.25X0.85MM_NO_SILK]
JP757  M01PTH_SMD_3.25X0.85MM_NO_SILK  [1X01_SMD_3.25X0.85MM_NO_SILK]
JP758  M01PTH_SMD_3.25X0.85MM_NO_SILK  [1X01_SMD_3.25X0.85MM_NO_SILK]
JP759  M01PTH_SMD_3.25X0.85MM_NO_SILK  [1X01_SMD_3.25X0.85MM_NO_SILK]
JP760  M01PTH_SMD_3.25X0.85MM_NO_SILK  [1X01_SMD_3.25X0.85MM_NO_SILK]
JP761  M01PTH_SMD_3.25X0.85MM_NO_SILK  [1X01_SMD_3.25X0.85MM_NO_SILK]
JP762  M01PTH_SMD_3.25X0.85MM_NO_SILK  [1X01_SMD_3.25X0.85MM_NO_SILK]
JP763  M01PTH_SMD_3.25X0.85MM_NO_SILK  [1X01_SMD_3.25X0.85MM_NO_SILK]
JP764  M01PTH_SMD_3.25X0.85MM_NO_SILK  [1X01_SMD_3.25X0.85MM_NO_SILK]
JP765  M01PTH_SMD_3.25X0.85MM_NO_SILK  [1X01_SMD_3.25X0.85MM_NO_SILK]
JP766  M01PTH_SMD_3.25X0.85MM_NO_SILK  [1X01_SMD_3.25X0.85MM_NO_SILK]
JP767  M01PTH_SMD_3.25X0.85MM_NO_SILK  [1X01_SMD_3.25X0.85MM_NO_SILK]
JP768  M01PTH_SMD_3.25X0.85MM_NO_SILK  [1X01_SMD_3.25X0.85MM_NO_SILK]
JP769  M01PTH_SMD_3.25X0.85MM_NO_SILK  [1X01_SMD_3.25X0.85MM_NO_SILK]
JP770  M01PTH_SMD_3.25X0.85MM_NO_SILK  [1X01_SMD_3.25X0.85MM_NO_SILK]
JP771  M01PTH_SMD_3.25X0.85MM_NO_SILK  [1X01_SMD_3.25X0.85MM_NO_SILK]
JP772  M01PTH_SMD_3.25X0.85MM_NO_SILK  [1X01_SMD_3.25X0.85MM_NO_SILK]
JP773  M01PTH_SMD_3.25X0.85MM_NO_SILK  [1X01_SMD_3.25X0.85MM_NO_SILK]
JP774  M01PTH_SMD_3.25X0.85MM_NO_SILK  [1X01_SMD_3.25X0.85MM_NO_SILK]
JP775  M01PTH_SMD_3.25X0.85MM_NO_SILK  [1X01_SMD_3.25X0.85MM_NO_SILK]
JP776  M01PTH_SMD_3.25X0.85MM_NO_SILK  [1X01_SMD_3.25X0.85MM_NO_SILK]
JP777  M01PTH_SMD_3.25X0.85MM_NO_SILK  [1X01_SMD_3.25X0.85MM_NO_SILK]
JP778  M01PTH_SMD_3.25X0.85MM_NO_SILK  [1X01_SMD_3.25X0.85MM_NO_SILK]
JP779  M01PTH_SMD_3.25X0.85MM_NO_SILK  [1X01_SMD_3.25X0.85MM_NO_SILK]
JP780  M01PTH_SMD_3.25X0.85MM_NO_SILK  [1X01_SMD_3.25X0.85MM_NO_SILK]
JP781  M01PTH_SMD_3.25X0.85MM_NO_SILK  [1X01_SMD_3.25X0.85MM_NO_SILK]
JP782  M01PTH_SMD_3.25X0.85MM_NO_SILK  [1X01_SMD_3.25X0.85MM_NO_SILK]
JP783  M01PTH_SMD_3.25X0.85MM_NO_SILK  [1X01_SMD_3.25X0.85MM_NO_SILK]
JP784  M01PTH_SMD_3.25X0.85MM_NO_SILK  [1X01_SMD_3.25X0.85MM_NO_SILK]
JP785  M01PTH_SMD_3.25X0.85MM_NO_SILK  [1X01_SMD_3.25X0.85MM_NO_SILK]
JP786  M01PTH_SMD_3.25X0.85MM_NO_SILK  [1X01_SMD_3.25X0.85MM_NO_SILK]
JP787  M01PTH_SMD_3.25X0.85MM_NO_SILK  [1X01_SMD_3.25X0.85MM_NO_SILK]
JP788  M01PTH_SMD_3.25X0.85MM_NO_SILK  [1X01_SMD_3.25X0.85MM_NO_SILK]
JP789  M01PTH_SMD_3.25X0.85MM_NO_SILK  [1X01_SMD_3.25X0.85MM_NO_SILK]
JP790  M01PTH_SMD_3.25X0.85MM_NO_SILK  [1X01_SMD_3.25X0.85MM_NO_SILK]
JP791  M01PTH_SMD_3.25X0.85MM_NO_SILK  [1X01_SMD_3.25X0.85MM_NO_SILK]
JP792  M01PTH_SMD_3.25X0.85MM_NO_SILK  [1X01_SMD_3.25X0.85MM_NO_SILK]
JP793  M01PTH_SMD_3.25X0.85MM_NO_SILK  [1X01_SMD_3.25X0.85MM_NO_SILK]
JP794  M01PTH_SMD_3.25X0.85MM_NO_SILK  [1X01_SMD_3.25X0.85MM_NO_SILK]
JP795  M01PTH_SMD_3.25X0.85MM_NO_SILK  [1X01_SMD_3.25X0.85MM_NO_SILK]
JP796  M01PTH_SMD_3.25X0.85MM_NO_SILK  [1X01_SMD_3.25X0.85MM_NO_SILK]
JP797  M01PTH_SMD_3.25X0.85MM_NO_SILK  [1X01_SMD_3.25X0.85MM_NO_SILK]
JP798  M01PTH_SMD_3.25X0.85MM_NO_SILK  [1X01_SMD_3.25X0.85MM_NO_SILK]
JP799  M01PTH_SMD_3.25X0.85MM_NO_SILK  [1X01_SMD_3.25X0.85MM_NO_SILK]
JP800  M01PTH_SMD_3.25X0.85MM_NO_SILK  [1X01_SMD_3.25X0.85MM_NO_SILK]
JP801  M01PTH_SMD_3.25X0.85MM_NO_SILK  [1X01_SMD_3.25X0.85MM_NO_SILK]
JP802  M01PTH_SMD_3.25X0.85MM_NO_SILK  [1X01_SMD_3.25X0.85MM_NO_SILK]
JP803  M01PTH_SMD_3.25X0.85MM_NO_SILK  [1X01_SMD_3.25X0.85MM_NO_SILK]
JP804  M01PTH_SMD_3.25X0.85MM_NO_SILK  [1X01_SMD_3.25X0.85MM_NO_SILK]
JP805  M01PTH_SMD_3.25X0.85MM_NO_SILK  [1X01_SMD_3.25X0.85MM_NO_SILK]
JP806  M01PTH_SMD_3.25X0.85MM_NO_SILK  [1X01_SMD_3.25X0.85MM_NO_SILK]
JP807  M01PTH_SMD_3.25X0.85MM_NO_SILK  [1X01_SMD_3.25X0.85MM_NO_SILK]
JP808  M01PTH_SMD_3.25X0.85MM_NO_SILK  [1X01_SMD_3.25X0.85MM_NO_SILK]
JP809  M01PTH_SMD_3.25X0.85MM_NO_SILK  [1X01_SMD_3.25X0.85MM_NO_SILK]
JP810  M01PTH_SMD_3.25X0.85MM_NO_SILK  [1X01_SMD_3.25X0.85MM_NO_SILK]
JP811  M01PTH_SMD_3.25X0.85MM_NO_SILK  [1X01_SMD_3.25X0.85MM_NO_SILK]
JP812  M01PTH_SMD_3.25X0.85MM_NO_SILK  [1X01_SMD_3.25X0.85MM_NO_SILK]
JP813  M01PTH_SMD_3.25X0.85MM_NO_SILK  [1X01_SMD_3.25X0.85MM_NO_SILK]
JP814  M01PTH_SMD_3.25X0.85MM_NO_SILK  [1X01_SMD_3.25X0.85MM_NO_SILK]
JP815  M01PTH_SMD_3.25X0.85MM_NO_SILK  [1X01_SMD_3.25X0.85MM_NO_SILK]
JP816  M01PTH_SMD_3.25X0.85MM_NO_SILK  [1X01_SMD_3.25X0.85MM_NO_SILK]
JP817  M01PTH_SMD_3.25X0.85MM_NO_SILK  [1X01_SMD_3.25X0.85MM_NO_SILK]
JP818  M01PTH_SMD_3.25X0.85MM_NO_SILK  [1X01_SMD_3.25X0.85MM_NO_SILK]
JP819  M01PTH_SMD_3.25X0.85MM_NO_SILK  [1X01_SMD_3.25X0.85MM_NO_SILK]
JP820  M01PTH_SMD_3.25X0.85MM_NO_SILK  [1X01_SMD_3.25X0.85MM_NO_SILK]
JP821  M01PTH_SMD_3.25X0.85MM_NO_SILK  [1X01_SMD_3.25X0.85MM_NO_SILK]
JP822  M01PTH_SMD_3.25X0.85MM_NO_SILK  [1X01_SMD_3.25X0.85MM_NO_SILK]
JP823  M01PTH_SMD_3.25X0.85MM_NO_SILK  [1X01_SMD_3.25X0.85MM_NO_SILK]
JP824  M01PTH_SMD_3.25X0.85MM_NO_SILK  [1X01_SMD_3.25X0.85MM_NO_SILK]
JP825  M01PTH_SMD_3.25X0.85MM_NO_SILK  [1X01_SMD_3.25X0.85MM_NO_SILK]
JP826  M01PTH_SMD_3.25X0.85MM_NO_SILK  [1X01_SMD_3.25X0.85MM_NO_SILK]
JP827  M01PTH_SMD_3.25X0.85MM_NO_SILK  [1X01_SMD_3.25X0.85MM_NO_SILK]
JP828  M01PTH_SMD_3.25X0.85MM_NO_SILK  [1X01_SMD_3.25X0.85MM_NO_SILK]
JP829  M01PTH_SMD_3.25X0.85MM_NO_SILK  [1X01_SMD_3.25X0.85MM_NO_SILK]
JP830  M01PTH_SMD_3.25X0.85MM_NO_SILK  [1X01_SMD_3.25X0.85MM_NO_SILK]
JP831  M01PTH_SMD_3.25X0.85MM_NO_SILK  [1X01_SMD_3.25X0.85MM_NO_SILK]
JP832  M01PTH_SMD_3.25X0.85MM_NO_SILK  [1X01_SMD_3.25X0.85MM_NO_SILK]
JP833  M01PTH_SMD_3.25X0.85MM_NO_SILK  [1X01_SMD_3.25X0.85MM_NO_SILK]
JP834  M01PTH_SMD_3.25X0.85MM_NO_SILK  [1X01_SMD_3.25X0.85MM_NO_SILK]
JP835  M01PTH_SMD_3.25X0.85MM_NO_SILK  [1X01_SMD_3.25X0.85MM_NO_SILK]
JP836  M01PTH_SMD_3.25X0.85MM_NO_SILK  [1X01_SMD_3.25X0.85MM_NO_SILK]
JP837  M01PTH_SMD_3.25X0.85MM_NO_SILK  [1X01_SMD_3.25X0.85MM_NO_SILK]
JP838  M01PTH_SMD_3.25X0.85MM_NO_SILK  [1X01_SMD_3.25X0.85MM_NO_SILK]
JP839  M01PTH_SMD_3.25X0.85MM_NO_SILK  [1X01_SMD_3.25X0.85MM_NO_SILK]
JP840  M01PTH_SMD_3.25X0.85MM_NO_SILK  [1X01_SMD_3.25X0.85MM_NO_SILK]
JP841  M01PTH_SMD_3.25X0.85MM_NO_SILK  [1X01_SMD_3.25X0.85MM_NO_SILK]
JP842  M01PTH_SMD_3.25X0.85MM_NO_SILK  [1X01_SMD_3.25X0.85MM_NO_SILK]
JP843  M01PTH_SMD_3.25X0.85MM_NO_SILK  [1X01_SMD_3.25X0.85MM_NO_SILK]
JP844  M01PTH_SMD_3.25X0.85MM_NO_SILK  [1X01_SMD_3.25X0.85MM_NO_SILK]
JP845  M01PTH_SMD_3.25X0.85MM_NO_SILK  [1X01_SMD_3.25X0.85MM_NO_SILK]
JP846  M01PTH_SMD_3.25X0.85MM_NO_SILK  [1X01_SMD_3.25X0.85MM_NO_SILK]
JP847  M01PTH_SMD_3.25X0.85MM_NO_SILK  [1X01_SMD_3.25X0.85MM_NO_SILK]
JP848  M01PTH_SMD_3.25X0.85MM_NO_SILK  [1X01_SMD_3.25X0.85MM_NO_SILK]
JP849  M01PTH_SMD_3.25X0.85MM_NO_SILK  [1X01_SMD_3.25X0.85MM_NO_SILK]
JP850  M01PTH_SMD_3.25X0.85MM_NO_SILK  [1X01_SMD_3.25X0.85MM_NO_SILK]
JP851  M01PTH_SMD_3.25X0.85MM_NO_SILK  [1X01_SMD_3.25X0.85MM_NO_SILK]
JP852  M01PTH_SMD_3.25X0.85MM_NO_SILK  [1X01_SMD_3.25X0.85MM_NO_SILK]
JP853  M01PTH_SMD_3.25X0.85MM_NO_SILK  [1X01_SMD_3.25X0.85MM_NO_SILK]
JP854  M01PTH_SMD_3.25X0.85MM_NO_SILK  [1X01_SMD_3.25X0.85MM_NO_SILK]
JP855  M01PTH_SMD_3.25X0.85MM_NO_SILK  [1X01_SMD_3.25X0.85MM_NO_SILK]
JP856  M01PTH_SMD_3.25X0.85MM_NO_SILK  [1X01_SMD_3.25X0.85MM_NO_SILK]
JP857  M01PTH_SMD_3.25X0.85MM_NO_SILK  [1X01_SMD_3.25X0.85MM_NO_SILK]
JP858  M01PTH_SMD_3.25X0.85MM_NO_SILK  [1X01_SMD_3.25X0.85MM_NO_SILK]
JP859  M01PTH_SMD_3.25X0.85MM_NO_SILK  [1X01_SMD_3.25X0.85MM_NO_SILK]
JP860  M01PTH_SMD_3.25X0.85MM_NO_SILK  [1X01_SMD_3.25X0.85MM_NO_SILK]
JP861  M01PTH_SMD_3.25X0.85MM_NO_SILK  [1X01_SMD_3.25X0.85MM_NO_SILK]
JP862  M01PTH_SMD_3.25X0.85MM_NO_SILK  [1X01_SMD_3.25X0.85MM_NO_SILK]
JP863  M01PTH_SMD_3.25X0.85MM_NO_SILK  [1X01_SMD_3.25X0.85MM_NO_SILK]
JP864  M01PTH_SMD_3.25X0.85MM_NO_SILK  [1X01_SMD_3.25X0.85MM_NO_SILK]
JP865  M01PTH_SMD_3.25X0.85MM_NO_SILK  [1X01_SMD_3.25X0.85MM_NO_SILK]
JP866  M01PTH_SMD_3.25X0.85MM_NO_SILK  [1X01_SMD_3.25X0.85MM_NO_SILK]
JP867  M01PTH_SMD_3.25X0.85MM_NO_SILK  [1X01_SMD_3.25X0.85MM_NO_SILK]
JP868  M01PTH_SMD_3.25X0.85MM_NO_SILK  [1X01_SMD_3.25X0.85MM_NO_SILK]
JP869  M01PTH_SMD_3.25X0.85MM_NO_SILK  [1X01_SMD_3.25X0.85MM_NO_SILK]
JP870  M01PTH_SMD_3.25X0.85MM_NO_SILK  [1X01_SMD_3.25X0.85MM_NO_SILK]
JP871  M01PTH_SMD_3.25X0.85MM_NO_SILK  [1X01_SMD_3.25X0.85MM_NO_SILK]
JP872  M01PTH_SMD_3.25X0.85MM_NO_SILK  [1X01_SMD_3.25X0.85MM_NO_SILK]
JP873  M01PTH_SMD_3.25X0.85MM_NO_SILK  [1X01_SMD_3.25X0.85MM_NO_SILK]
JP874  M01PTH_SMD_3.25X0.85MM_NO_SILK  [1X01_SMD_3.25X0.85MM_NO_SILK]
JP875  M01PTH_SMD_3.25X0.85MM_NO_SILK  [1X01_SMD_3.25X0.85MM_NO_SILK]
JP876  M01PTH_SMD_3.25X0.85MM_NO_SILK  [1X01_SMD_3.25X0.85MM_NO_SILK]
JP877  M01PTH_SMD_3.25X0.85MM_NO_SILK  [1X01_SMD_3.25X0.85MM_NO_SILK]
JP878  M01PTH_SMD_3.25X0.85MM_NO_SILK  [1X01_SMD_3.25X0.85MM_NO_SILK]
JP879  M01PTH_SMD_3.25X0.85MM_NO_SILK  [1X01_SMD_3.25X0.85MM_NO_SILK]
JP880  M01PTH_SMD_3.25X0.85MM_NO_SILK  [1X01_SMD_3.25X0.85MM_NO_SILK]
JP881  M01PTH_SMD_3.25X0.85MM_NO_SILK  [1X01_SMD_3.25X0.85MM_NO_SILK]
JP882  M01PTH_SMD_3.25X0.85MM_NO_SILK  [1X01_SMD_3.25X0.85MM_NO_SILK]
JP883  M01PTH_SMD_3.25X0.85MM_NO_SILK  [1X01_SMD_3.25X0.85MM_NO_SILK]
JP884  M01PTH_SMD_3.25X0.85MM_NO_SILK  [1X01_SMD_3.25X0.85MM_NO_SILK]
JP885  M01PTH_SMD_3.25X0.85MM_NO_SILK  [1X01_SMD_3.25X0.85MM_NO_SILK]
JP886  M01PTH_SMD_3.25X0.85MM_NO_SILK  [1X01_SMD_3.25X0.85MM_NO_SILK]
JP887  M01PTH_SMD_3.25X0.85MM_NO_SILK  [1X01_SMD_3.25X0.85MM_NO_SILK]
JP888  M01PTH_SMD_3.25X0.85MM_NO_SILK  [1X01_SMD_3.25X0.85MM_NO_SILK]
JP889  M01PTH_SMD_3.25X0.85MM_NO_SILK  [1X01_SMD_3.25X0.85MM_NO_SILK]
JP890  M01PTH_SMD_3.25X0.85MM_NO_SILK  [1X01_SMD_3.25X0.85MM_NO_SILK]
JP891  M01PTH_SMD_3.25X0.85MM_NO_SILK  [1X01_SMD_3.25X0.85MM_NO_SILK]
JP892  M01PTH_SMD_3.25X0.85MM_NO_SILK  [1X01_SMD_3.25X0.85MM_NO_SILK]
JP893  M01PTH_SMD_3.25X0.85MM_NO_SILK  [1X01_SMD_3.25X0.85MM_NO_SILK]
JP894  M01PTH_SMD_3.25X0.85MM_NO_SILK  [1X01_SMD_3.25X0.85MM_NO_SILK]
JP895  M01PTH_SMD_3.25X0.85MM_NO_SILK  [1X01_SMD_3.25X0.85MM_NO_SILK]
JP896  M01PTH_SMD_3.25X0.85MM_NO_SILK  [1X01_SMD_3.25X0.85MM_NO_SILK]